# EAGLE schematic csa_ultracpu (EAGLE 6.4)

## Sheet 1 of 6: BUS I/O
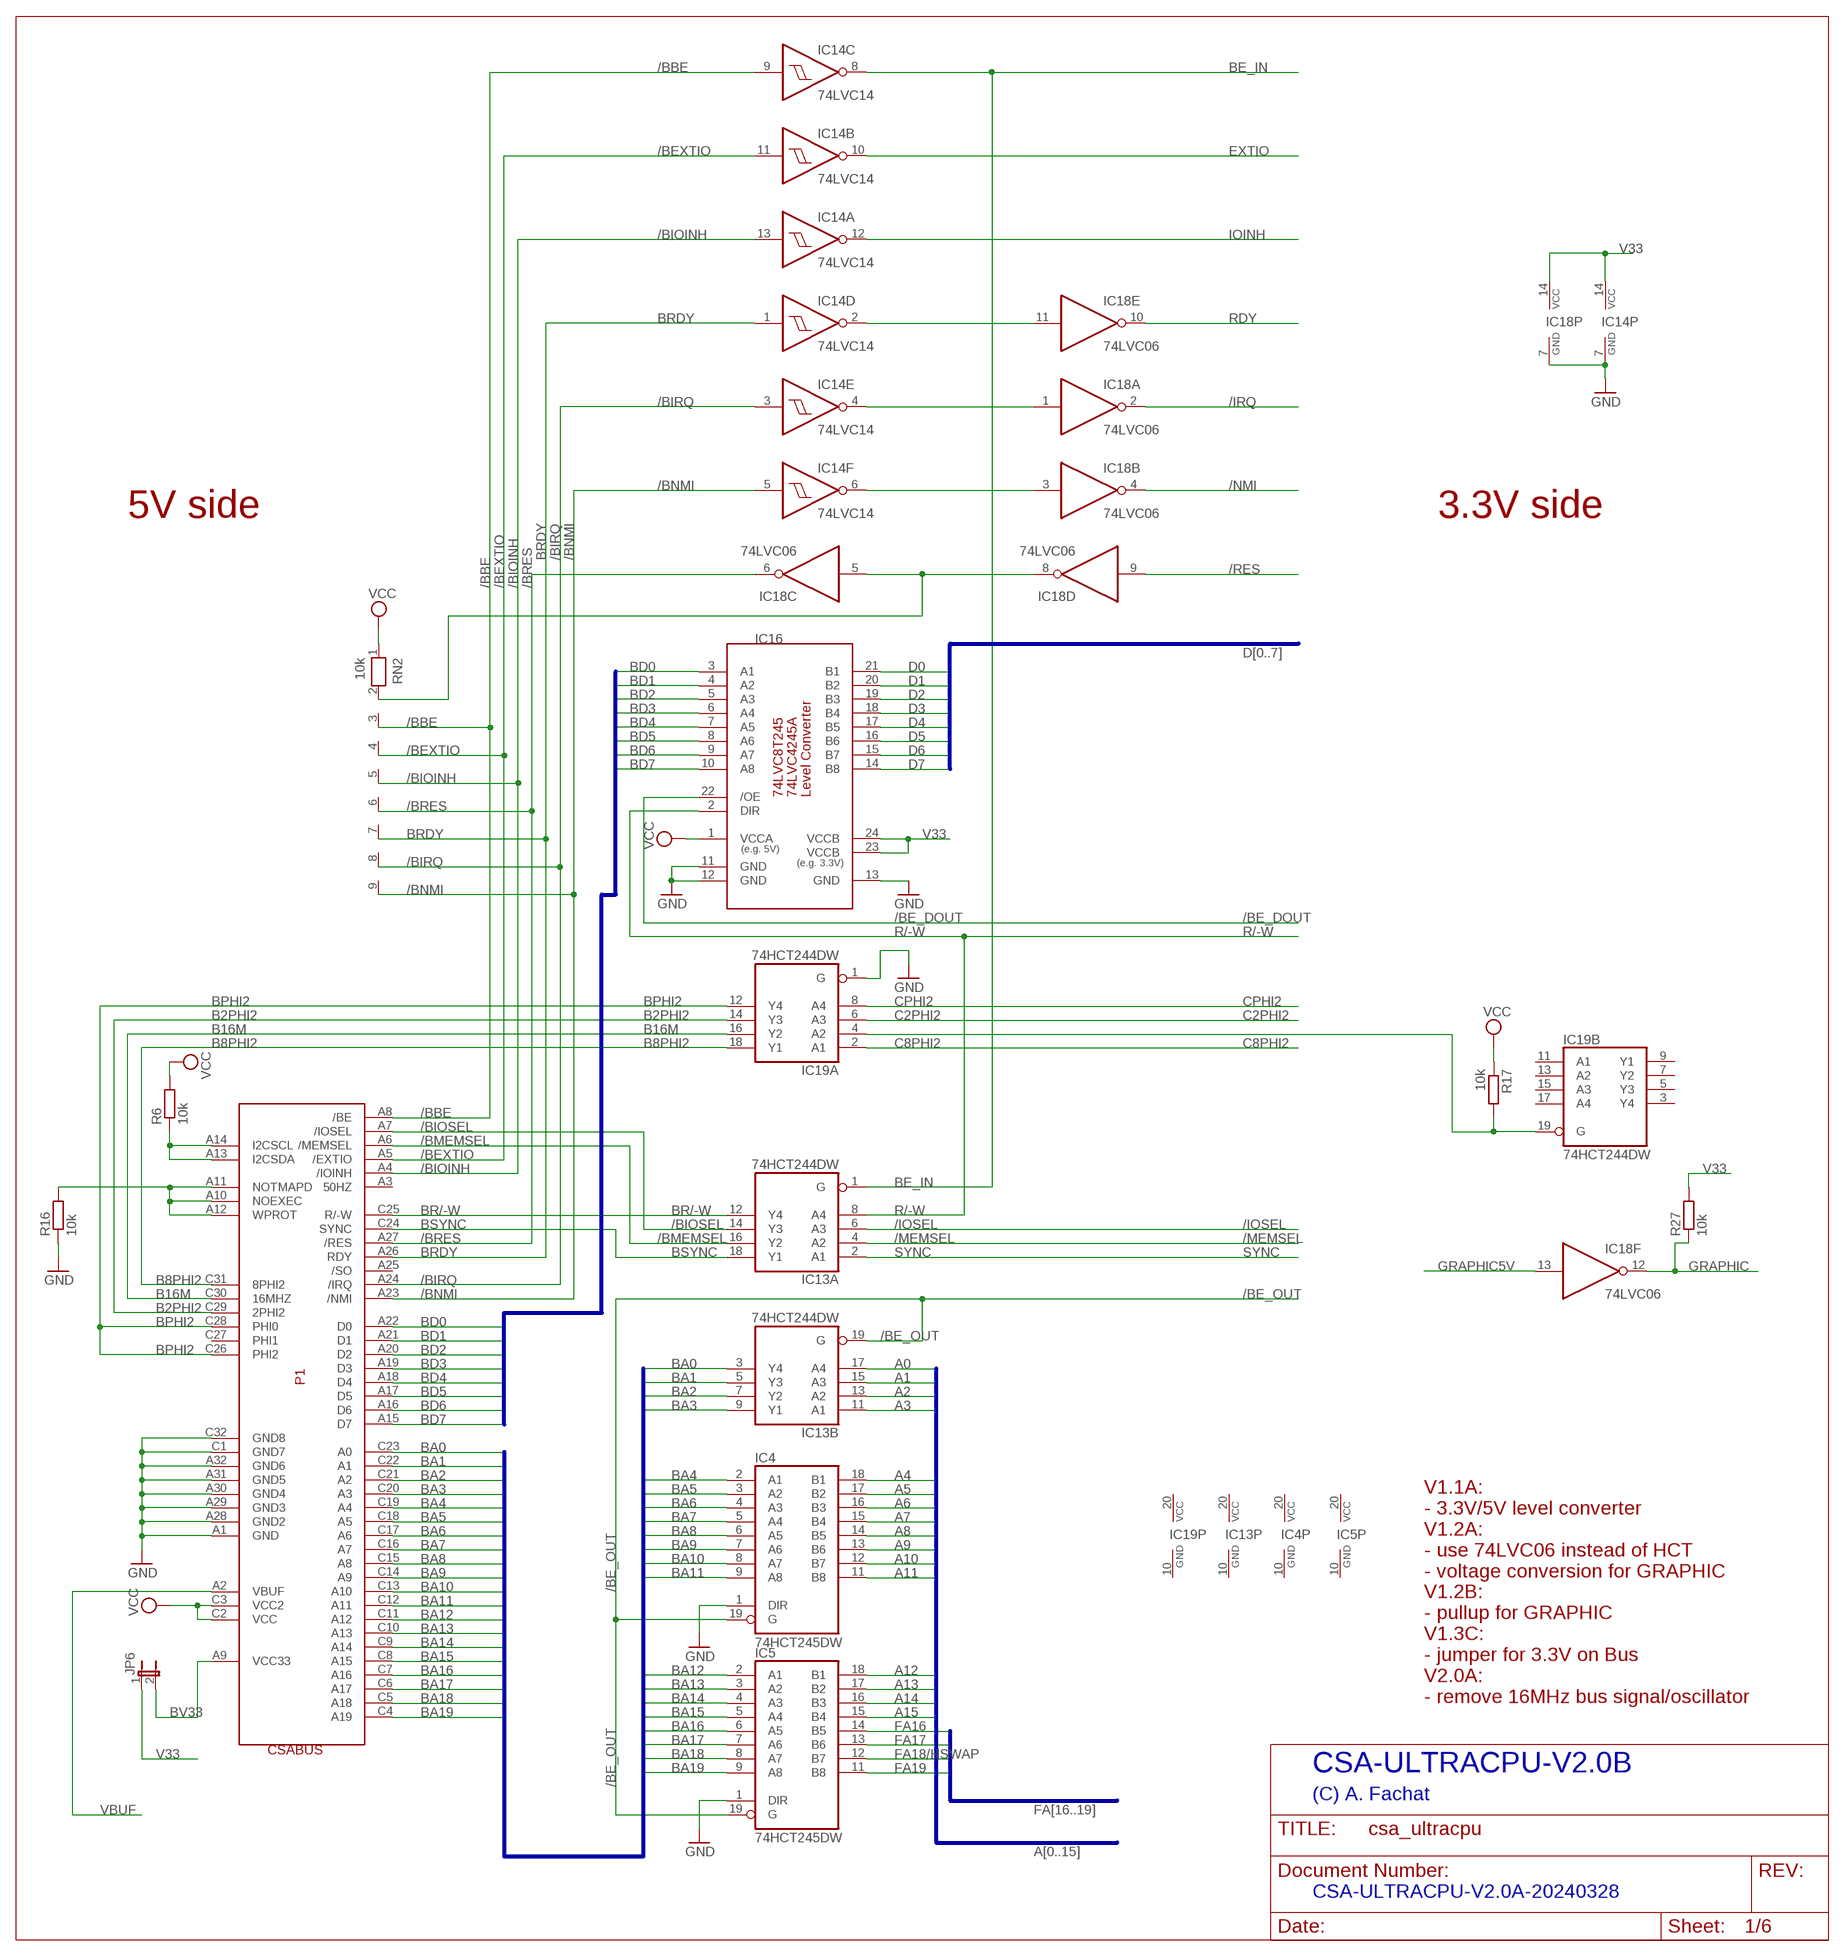
[diagram p0: schematic, sheet 1]

### Parts
IC4  74HCT245DW  74LS245DW  [SO20W]
IC5  74HCT245DW  74LS245DW  [SO20W]
IC13  74HCT244DW  [SO20W]
IC14  74LVC14  74HCT14D  [SO14]
IC16  74LVC8T245SO24  [SO24L]
IC18  74LVC06  74LS06D  [SO14]
IC19  74HCT244DW  [SO20W]
JP6  JP1E  [JP1]
P1  CSABUS  [CSABUS]
R6  10k  R-EU_0204/5  [0204/5]
R16  10k  R-EU_0204/5  [0204/5]
R17  10k  R-EU_0204/5  [0204/5]
R27  10k  R-EU_0204/5  [0204/5]
RN2  10k  RN08  [RN-9]

### Nets
/BBE: IC14.9(C:I) P1.A8(/BE) RN2.3
/BE_DOUT: IC16.22(/OE) ; also sheet 2
/BE_OUT: IC4.19(G) IC5.19(G) IC13.19(B:G) ; also sheet 2
/BEXTIO: IC14.11(B:I) P1.A5(/EXTIO) RN2.4
/BIOINH: IC14.13(A:I) P1.A4(/IOINH) RN2.5
/BIOSEL: IC13.14(A:Y3) P1.A7(/IOSEL)
/BIRQ: IC14.3(E:I) P1.A24(/IRQ) RN2.8
/BMEMSEL: IC13.16(A:Y2) P1.A6(/MEMSEL)
/BNMI: IC14.5(F:I) P1.A23(/NMI) RN2.9
/BRES: IC18.6(C:O) P1.A27(/RES) RN2.6
/IOSEL: IC13.6(A:A3) ; also sheet 2
/IRQ: IC18.2(A:O) ; also sheet 2,5
/MEMSEL: IC13.4(A:A2) ; also sheet 2
/NMI: IC18.4(B:O) ; also sheet 2
/RES: IC18.9(D:I) ; also sheet 2,3,5
A0: IC13.17(B:A4) ; also sheet 2
A1: IC13.15(B:A3) ; also sheet 2
A2: IC13.13(B:A2) ; also sheet 2
A3: IC13.11(B:A1) ; also sheet 2
A4: IC4.18(B1) ; also sheet 2
A5: IC4.17(B2) ; also sheet 2
A6: IC4.16(B3) ; also sheet 2
A7: IC4.15(B4) ; also sheet 2
A8: IC4.14(B5) ; also sheet 2
A9: IC4.13(B6) ; also sheet 2
A10: IC4.12(B7) ; also sheet 2
A11: IC4.11(B8) ; also sheet 2
A12: IC5.18(B1) ; also sheet 2
A13: IC5.17(B2) ; also sheet 2
A14: IC5.16(B3) ; also sheet 2
A15: IC5.15(B4) ; also sheet 2
B2PHI2: IC19.14(A:Y3) P1.C29(2PHI2)
B8PHI2: IC19.18(A:Y1) P1.C31(8PHI2)
B16M: IC19.16(A:Y2) P1.C30(16MHZ)
BA0: IC13.3(B:Y4) P1.C23(A0)
BA1: IC13.5(B:Y3) P1.C22(A1)
BA2: IC13.7(B:Y2) P1.C21(A2)
BA3: IC13.9(B:Y1) P1.C20(A3)
BA4: IC4.2(A1) P1.C19(A4)
BA5: IC4.3(A2) P1.C18(A5)
BA6: IC4.4(A3) P1.C17(A6)
BA7: IC4.5(A4) P1.C16(A7)
BA8: IC4.6(A5) P1.C15(A8)
BA9: IC4.7(A6) P1.C14(A9)
BA10: IC4.8(A7) P1.C13(A10)
BA11: IC4.9(A8) P1.C12(A11)
BA12: IC5.2(A1) P1.C11(A12)
BA13: IC5.3(A2) P1.C10(A13)
BA14: IC5.4(A3) P1.C9(A14)
BA15: IC5.5(A4) P1.C8(A15)
BA16: IC5.6(A5) P1.C7(A16)
BA17: IC5.7(A6) P1.C6(A17)
BA18: IC5.8(A7) P1.C5(A18)
BA19: IC5.9(A8) P1.C4(A19)
BD0: IC16.3(A1) P1.A22(D0)
BD1: IC16.4(A2) P1.A21(D1)
BD2: IC16.5(A3) P1.A20(D2)
BD3: IC16.6(A4) P1.A19(D3)
BD4: IC16.7(A5) P1.A18(D4)
BD5: IC16.8(A6) P1.A17(D5)
BD6: IC16.9(A7) P1.A16(D6)
BD7: IC16.10(A8) P1.A15(D7)
BE_IN: IC13.1(A:G) IC14.8(C:O) ; also sheet 2
BPHI2: IC19.12(A:Y4) P1.C26(PHI2) P1.C28(PHI0)
BR/-W: IC13.12(A:Y4) P1.C25(R/-W)
BRDY: IC14.1(D:I) P1.A26(RDY) RN2.7
BSYNC: IC13.18(A:Y1) P1.C24(SYNC)
BV33: JP6.2 P1.A9(VCC33)
C2PHI2: IC19.6(A:A3) ; also sheet 2
C8PHI2: IC19.2(A:A1) ; also sheet 2
CPHI2: IC19.8(A:A4) ; also sheet 2
D0: IC16.21(B1) ; also sheet 2
D1: IC16.20(B2) ; also sheet 2
D2: IC16.19(B3) ; also sheet 2
D3: IC16.18(B4) ; also sheet 2
D4: IC16.17(B5) ; also sheet 2
D5: IC16.16(B6) ; also sheet 2
D6: IC16.15(B7) ; also sheet 2
D7: IC16.14(B8) ; also sheet 2
EXTIO: IC14.10(B:O) ; also sheet 2
FA16: IC5.14(B5) ; also sheet 2
FA17: IC5.13(B6) ; also sheet 2
FA18/HSWAP: IC5.12(B7) ; also sheet 2
FA19: IC5.11(B8) ; also sheet 2
GND: IC4.1(DIR) IC5.1(DIR) IC14.7(P:GND) IC16.11(GND) IC16.12(GND) IC16.13(GND) IC18.7(P:GND) IC19.1(A:G) P1.A1(GND) P1.A28(GND2) P1.A29(GND3) P1.A30(GND4) P1.A31(GND5) P1.A32(GND6) P1.C1(GND7) P1.C32(GND8) R16.1 ; also sheet 2,3,4,5,6
GRAPHIC: IC18.12(F:O) R27.1 ; also sheet 2
GRAPHIC5V: IC18.13(F:I) ; also sheet 2
IOINH: IC14.12(A:O) ; also sheet 2
N$2: IC14.4(E:O) IC18.1(A:I)
N$3: IC14.6(F:O) IC18.3(B:I)
N$4: IC18.5(C:I) IC18.8(D:O) RN2.2
N$5: IC14.2(D:O) IC18.11(E:I)
N$11: IC19.4(A:A2) IC19.19(B:G) R17.2
N$43: P1.A10(NOEXEC) P1.A11(NOTMAPD) P1.A12(WPROT) R16.2
N$44: P1.A13(I2CSDA) P1.A14(I2CSCL) R6.1
R/-W: IC13.8(A:A4) IC16.2(DIR) ; also sheet 2
RDY: IC18.10(E:O) ; also sheet 2
SYNC: IC13.2(A:A1) ; also sheet 2
V33: IC14.14(P:VCC) IC16.23(VCCB) IC16.24(VCCB) IC18.14(P:VCC) JP6.1 R27.2 ; also sheet 2,3,5,6
VBUF: P1.A2(VBUF) ; also sheet 5
VCC: IC16.1(VCCA) P1.C2(VCC) P1.C3(VCC2) R6.2 R17.1 RN2.1 ; also sheet 2,3,4,5
Unconnected: IC19.3(B:Y4) IC19.5(B:Y3) IC19.7(B:Y2) IC19.9(B:Y1) IC19.11(B:A1) IC19.13(B:A2) IC19.15(B:A3) IC19.17(B:A4) P1.A3(50HZ) P1.A25(/SO) P1.C27(PHI1)

### Buses
BD[0..7]
BA[0..19]
A[0..15]
D[0..7]
FA[16..19]

### Notes on the sheet
- 5V side | 3.3V side
- V1.1A:
  - 3.3V/5V level converter
  V1.2A:
  - use 74LVC06 instead of HCT
  - voltage conversion for GRAPHIC
  V1.2B:
  - pullup for GRAPHIC
  V1.3C:
  - jumper for 3.3V on Bus
  V2.0A:
  - remove 16MHz bus signal/oscillator
- CSA-ULTRACPU-V2.0B
- (C) A. Fachat
- CSA-ULTRACPU-V2.0A-20240328

## Sheet 2 of 6: CPU,RAM,ROM
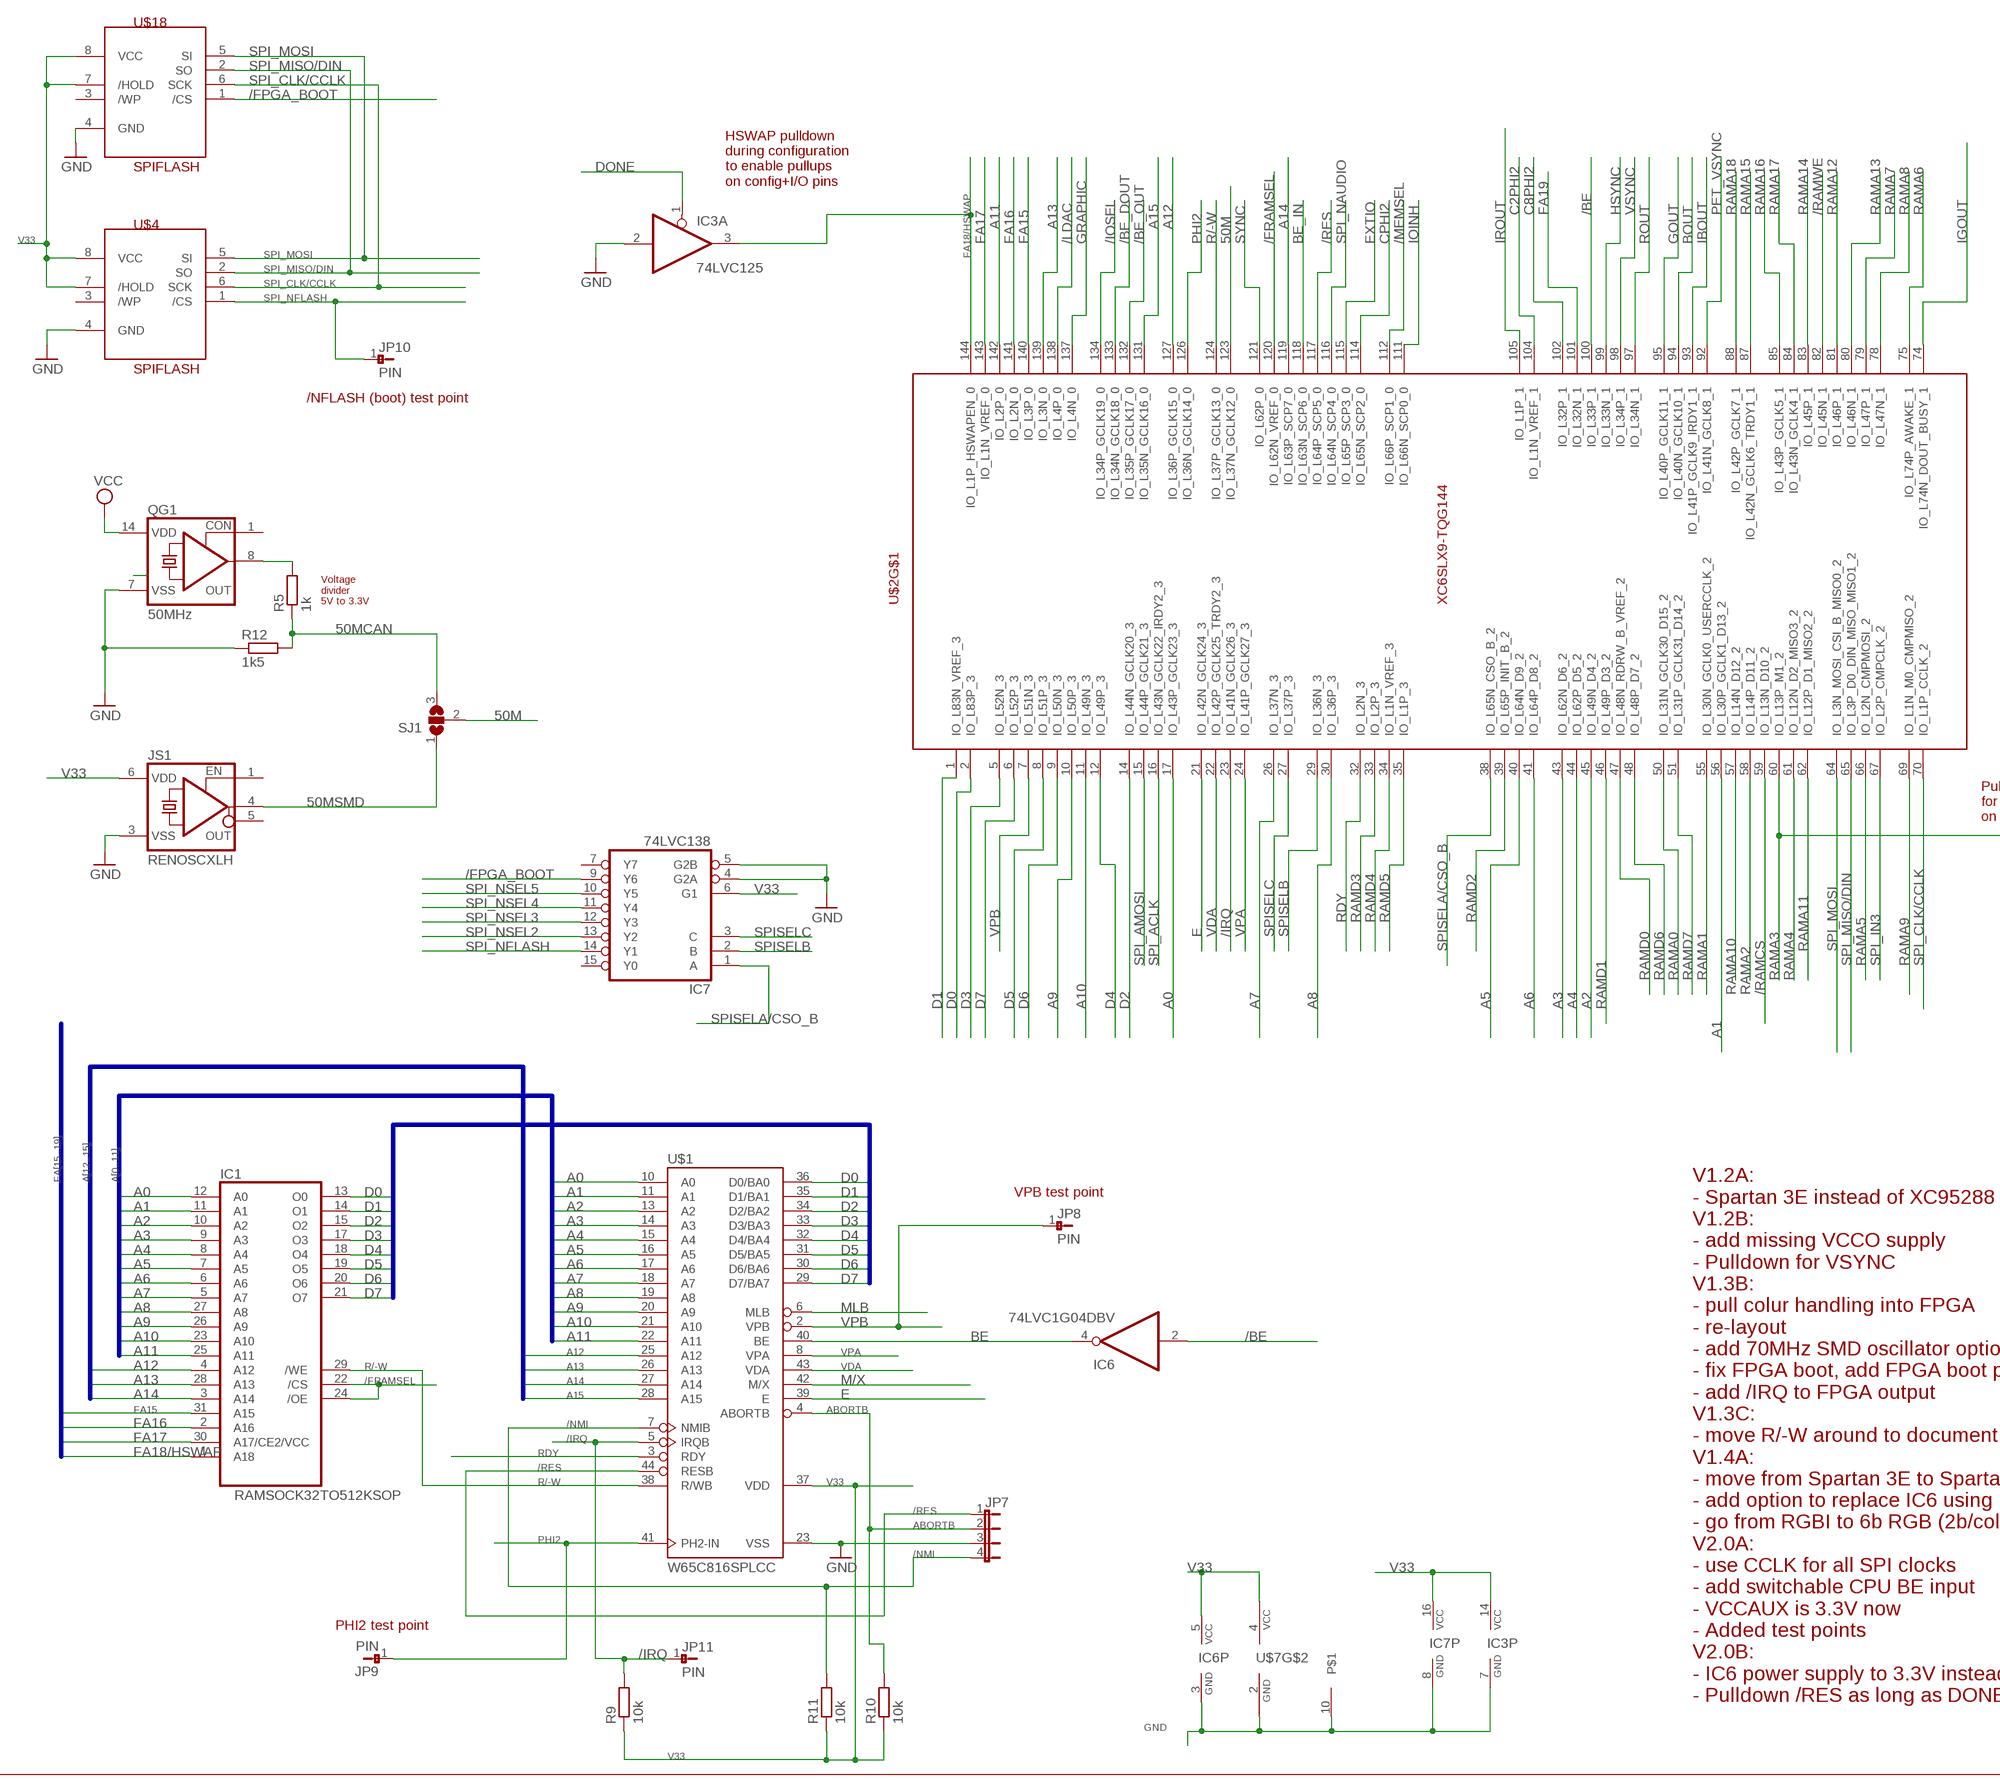
[diagram p1: schematic, sheet 2, part 1 of 2]
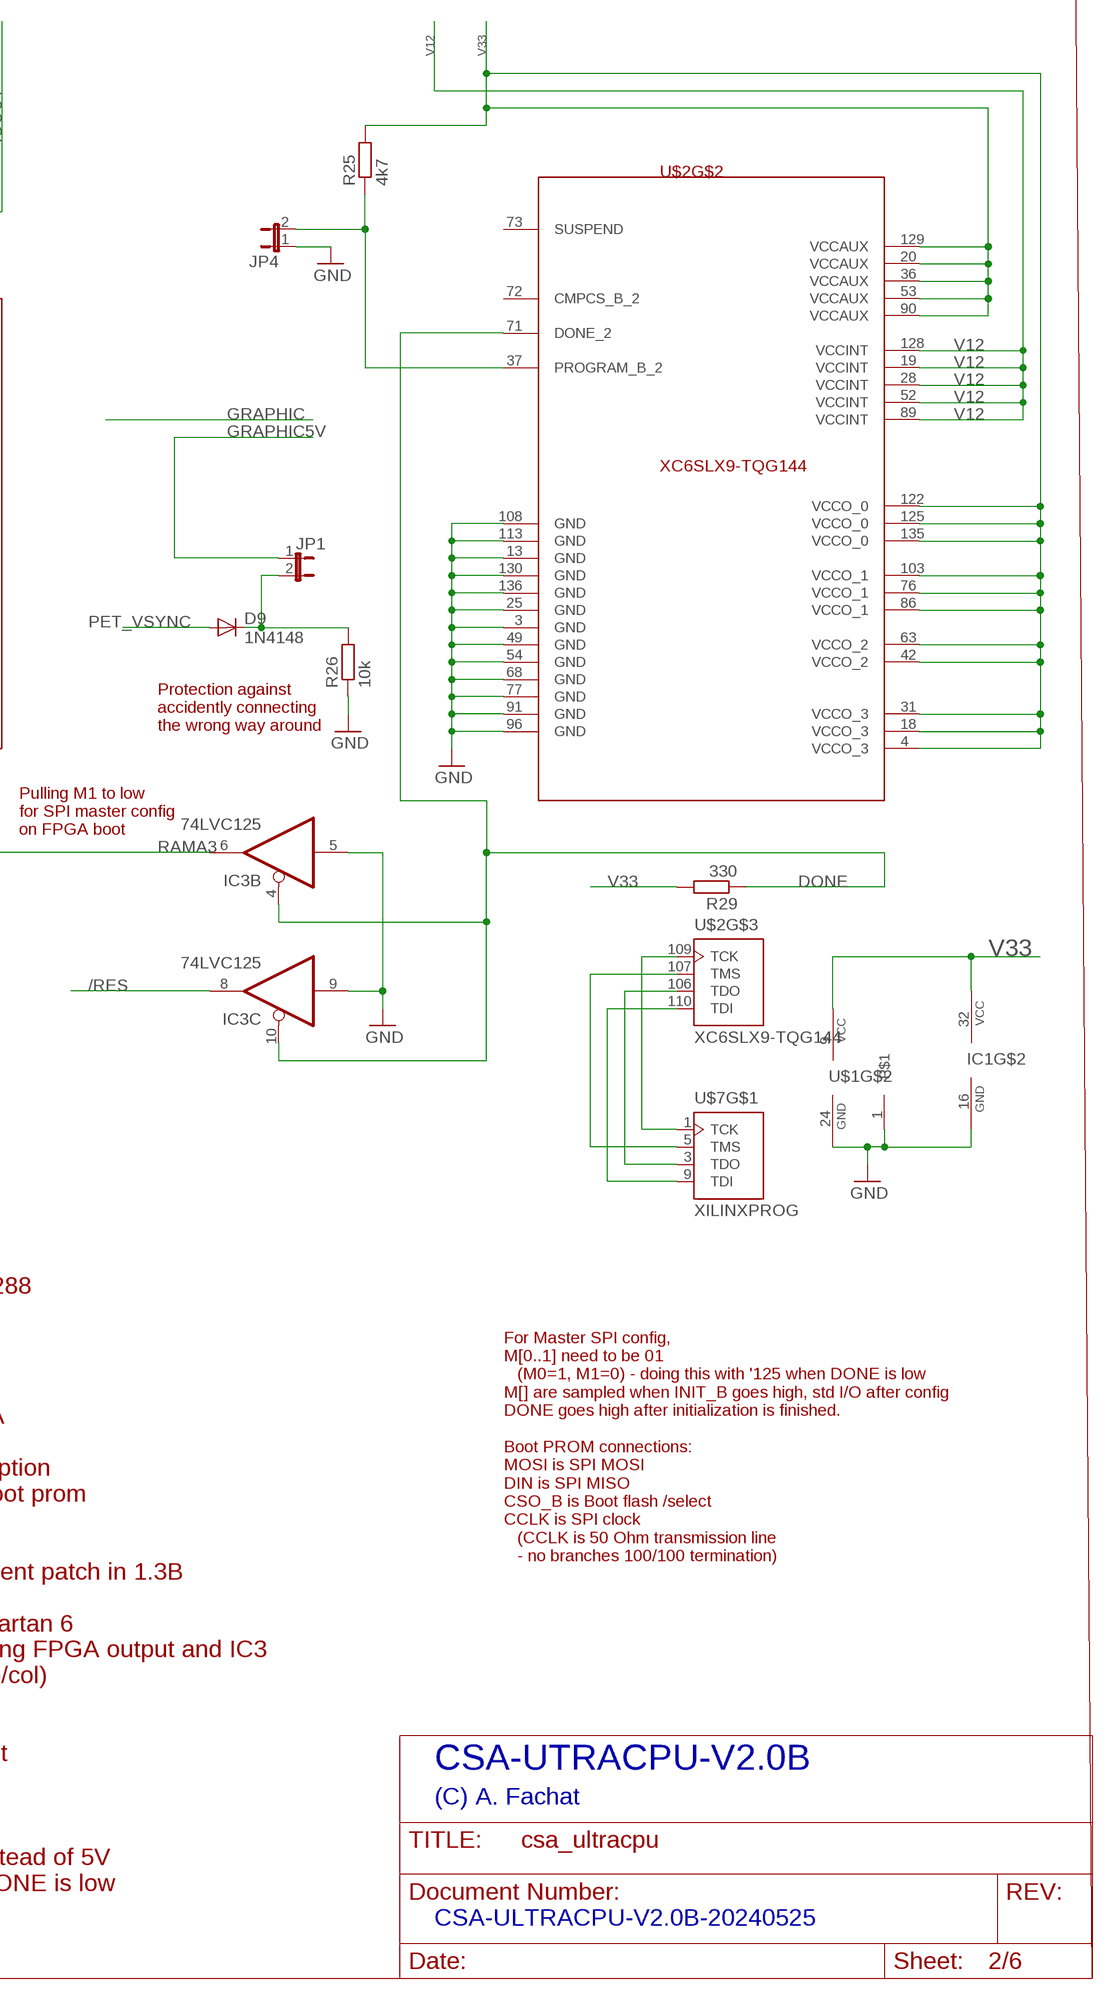
[diagram p2: schematic, sheet 2, part 2 of 2]

### Parts
D9  1N4148  DIODE-D-5  [D-5]
IC1  RAMSOCK32TO512KSOP  [SOP32]
IC3  74LVC125  74LS125D  [SO14]
IC6  74LVC1G04DBV  [SOT23-5]
IC7  74LVC138  74S138D  [SO16]
JP1  JP1E  [JP1]
JP4  JP1E  [JP1]
JP7  JP4E  [JP4]
JP8  PIN  [PIN]
JP9  PIN  [PIN]
JP10  PIN  [PIN]
JP11  PIN  [PIN]
JS1  RENOSCXLH  [RENJS6]
QG1  50MHz  CRYSTAL_RES-SG51  [SG51]
R5  1k  R-EU_0207/2V  [0207/2V]
R9  10k  R-EU_0207/2V  [0207/2V]
R10  10k  R-EU_0207/2V  [0207/2V]
R11  10k  R-EU_0207/2V  [0207/2V]
R12  1k5  R-EU_0207/2V  [0207/2V]
R25  4k7  R-EU_0207/2V  [0207/2V]
R26  10k  R-EU_0207/2V  [0207/2V]
R29  330  R-EU_0207/2V  [0207/2V]
SJ1  SJ2W  [SJ_2]
U$1  W65C816SPLCC  [PLCC44]
U$2  XC6SLX9-TQG144  XC9SLX9-TQG144  [TQFP144]
U$4  SPIFLASH  [DIL08]
U$7  XILINXPROG  [FLAT10BOX]
U$18  SPIFLASH  [DIL08]

### Nets
50M: SJ1.2 U$2.123(IO_L37N_GCLK12_0)
50MCAN: R5.1 R12.2 SJ1.3
50MSMD: JS1.4(OUT1) SJ1.1
/BE: IC6.2(I) U$2.100(IO_L33P_1)
/BE_DOUT: U$2.133(IO_L34N_GCLK18_0) ; also sheet 1
/BE_OUT: U$2.132(IO_L35P_GCLK17_0) ; also sheet 1
/FPGA_BOOT: IC7.9(Y6) U$18.1(/CS)
/FRAMSEL: IC1.22(/CS) IC1.24(/OE) U$2.120(IO_L62N_VREF_0)
/IOSEL: U$2.134(IO_L34P_GCLK19_0) ; also sheet 1
/IRQ: JP11.1 R9.2 U$1.5(IRQB) U$2.23(IO_L41N_GCLK26_3) ; also sheet 1,5
/LDAC: U$2.138(IO_L4P_0) ; also sheet 6
/MEMSEL: U$2.112(IO_L66P_SCP1_0) ; also sheet 1
/NMI: JP7.4 R11.2 U$1.7(NMIB) ; also sheet 1
/RAMCS: U$2.59(IO_L13N_D10_2) ; also sheet 6
/RAMWE: U$2.82(IO_L45N_1) ; also sheet 6
/RES: IC3.8(C:O) JP7.1 U$1.44(RESB) U$2.117(IO_L64P_SCP5_0) ; also sheet 1,3,5
A0: IC1.12(A0) U$1.10(A0) U$2.17(IO_L43P_GCLK23_3) ; also sheet 1
A1: IC1.11(A1) U$1.11(A1) U$2.56(IO_L30P_GCLK1_D13_2) ; also sheet 1
A2: IC1.10(A2) U$1.13(A2) U$2.45(IO_L49N_D4_2) ; also sheet 1
A3: IC1.9(A3) U$1.14(A3) U$2.43(IO_L62N_D6_2) ; also sheet 1
A4: IC1.8(A4) U$1.15(A4) U$2.44(IO_L62P_D5_2) ; also sheet 1
A5: IC1.7(A5) U$1.16(A5) U$2.40(IO_L64N_D9_2) ; also sheet 1
A6: IC1.6(A6) U$1.17(A6) U$2.41(IO_L64P_D8_2) ; also sheet 1
A7: IC1.5(A7) U$1.18(A7) U$2.26(IO_L37N_3) ; also sheet 1
A8: IC1.27(A8) U$1.19(A8) U$2.30(IO_L36P_3) ; also sheet 1
A9: IC1.26(A9) U$1.20(A9) U$2.10(IO_L50P_3) ; also sheet 1
A10: IC1.23(A10) U$1.21(A10) U$2.11(IO_L49N_3) ; also sheet 1
A11: IC1.25(A11) U$1.22(A11) U$2.142(IO_L2P_0) ; also sheet 1
A12: IC1.4(A12) U$1.25(A12) U$2.127(IO_L36P_GCLK15_0) ; also sheet 1
A13: IC1.28(A13) U$1.26(A13) U$2.139(IO_L3N_0) ; also sheet 1
A14: IC1.3(A14) U$1.27(A14) U$2.119(IO_L63P_SCP7_0) ; also sheet 1
A15: U$1.28(A15) U$2.131(IO_L35N_GCLK16_0) ; also sheet 1
ABORTB: JP7.2 R10.2 U$1.4(ABORTB)
BE: IC6.4(O) U$1.40(BE)
BE_IN: U$2.118(IO_L63N_SCP6_0) ; also sheet 1
BOUT: U$2.94(IO_L40N_GCLK10_1) ; also sheet 4
C2PHI2: U$2.104(IO_L1N_VREF_1) ; also sheet 1
C8PHI2: U$2.102(IO_L32P_1) ; also sheet 1
CPHI2: U$2.114(IO_L65N_SCP2_0) ; also sheet 1
D0: IC1.13(O0) U$1.36(D0/BA0) U$2.2(IO_L83P_3) ; also sheet 1
D1: IC1.14(O1) U$1.35(D1/BA1) U$2.1(IO_L83N_VREF_3) ; also sheet 1
D2: IC1.15(O2) U$1.34(D2/BA2) U$2.14(IO_L44N_GCLK20_3) ; also sheet 1
D3: IC1.17(O3) U$1.33(D3/BA3) U$2.5(IO_L52N_3) ; also sheet 1
D4: IC1.18(O4) U$1.32(D4/BA4) U$2.12(IO_L49P_3) ; also sheet 1
D5: IC1.19(O5) U$1.31(D5/BA5) U$2.8(IO_L51P_3) ; also sheet 1
D6: IC1.20(O6) U$1.30(D6/BA6) U$2.9(IO_L50N_3) ; also sheet 1
D7: IC1.21(O7) U$1.29(D7/BA7) U$2.6(IO_L52P_3) ; also sheet 1
DONE: IC3.1(A:OE) IC3.4(B:OE) IC3.10(C:OE) R29.1 U$2.71(DONE_2)
E: U$1.39(E) U$2.21(IO_L42N_GCLK24_3)
EXTIO: U$2.115(IO_L65P_SCP3_0) ; also sheet 1
FA15: IC1.31(A15) U$2.140(IO_L3P_0)
FA16: IC1.2(A16) U$2.141(IO_L2N_0) ; also sheet 1
FA17: IC1.30(A17/CE2/VCC) U$2.143(IO_L1N_VREF_0) ; also sheet 1
FA18/HSWAP: IC1.1(A18) IC3.3(A:O) U$2.144(IO_L1P_HSWAPEN_0) ; also sheet 1
FA19: U$2.101(IO_L32N_1) ; also sheet 1
GND: IC1.16(GND) IC3.2(A:I) IC3.5(B:I) IC3.7(P:GND) IC3.9(C:I) IC6.3(GND) IC7.4(G2A) IC7.5(G2B) IC7.8(GND) JP4.1 JP7.3 JS1.3(VSS) QG1.7(VSS) R12.1 R26.1 U$1.1 U$1.23(VSS) U$1.24(GND) U$2.3(GND) U$2.13(GND) U$2.25(GND) U$2.49(GND) U$2.54(GND) U$2.68(GND) U$2.77(GND) U$2.91(GND) U$2.96(GND) U$2.108(GND) U$2.113(GND) U$2.130(GND) U$2.136(GND) U$4.4(GND) U$7.2(GND) U$7.10 U$18.4(GND) ; also sheet 1,3,4,5,6
GOUT: U$2.95(IO_L40P_GCLK11_1) ; also sheet 4
GRAPHIC: U$2.137(IO_L4N_0) ; also sheet 1
GRAPHIC5V: JP1.1 ; also sheet 1
HSYNC: U$2.99(IO_L33N_1) ; also sheet 4
IBOUT: U$2.93(IO_L41P_GCLK9_IRDY1_1) ; also sheet 4
IGOUT: U$2.74(IO_L74N_DOUT_BUSY_1) ; also sheet 4
IOINH: U$2.111(IO_L66N_SCP0_0) ; also sheet 1
IROUT: U$2.105(IO_L1P_1) ; also sheet 4
M/X: U$1.42(M/X)
MLB: U$1.6(MLB)
N$7: QG1.8(OUT) R5.2
N$21: D9.C JP1.2 R26.2
PET_VSYNC: D9.A U$2.92(IO_L41N_GCLK8_1)
PHI2: JP9.1 U$1.41(PH2-IN) U$2.126(IO_L36N_GCLK14_0)
PROG_B: JP4.2 R25.1 U$2.37(PROGRAM_B_2)
R/-W: IC1.29(/WE) U$1.38(R/WB) U$2.124(IO_L37P_GCLK13_0) ; also sheet 1
RAMA0: U$2.50(IO_L31N_GCLK30_D15_2) ; also sheet 6
RAMA1: U$2.55(IO_L30N_GCLK0_USERCCLK_2) ; also sheet 6
RAMA2: U$2.58(IO_L14P_D11_2) ; also sheet 6
RAMA3: IC3.6(B:O) U$2.60(IO_L13P_M1_2) ; also sheet 6
RAMA4: U$2.61(IO_L12N_D2_MISO3_2) ; also sheet 6
RAMA5: U$2.66(IO_L2N_CMPMOSI_2) ; also sheet 6
RAMA6: U$2.75(IO_L74P_AWAKE_1) ; also sheet 6
RAMA7: U$2.79(IO_L47P_1) ; also sheet 6
RAMA8: U$2.78(IO_L47N_1) ; also sheet 6
RAMA9: U$2.69(IO_L1N_M0_CMPMISO_2) ; also sheet 6
RAMA10: U$2.57(IO_L14N_D12_2) ; also sheet 6
RAMA11: U$2.62(IO_L12P_D1_MISO2_2) ; also sheet 6
RAMA12: U$2.81(IO_L46P_1) ; also sheet 6
RAMA13: U$2.80(IO_L46N_1) ; also sheet 6
RAMA14: U$2.83(IO_L45P_1) ; also sheet 6
RAMA15: U$2.87(IO_L42N_GCLK6_TRDY1_1) ; also sheet 6
RAMA16: U$2.85(IO_L43P_GCLK5_1) ; also sheet 6
RAMA17: U$2.84(IO_L43N_GCLK4_1) ; also sheet 6
RAMA18: U$2.88(IO_L42P_GCLK7_1) ; also sheet 6
RAMD0: U$2.47(IO_L48N_RDRW_B_VREF_2) ; also sheet 6
RAMD1: U$2.46(IO_L49P_D3_2) ; also sheet 6
RAMD2: U$2.39(IO_L65P_INIT_B_2) ; also sheet 6
RAMD3: U$2.33(IO_L2P_3) ; also sheet 6
RAMD4: U$2.34(IO_L1N_VREF_3) ; also sheet 6
RAMD5: U$2.35(IO_L1P_3) ; also sheet 6
RAMD6: U$2.48(IO_L48P_D7_2) ; also sheet 6
RAMD7: U$2.51(IO_L31P_GCLK31_D14_2) ; also sheet 6
RDY: U$1.3(RDY) U$2.32(IO_L2N_3) ; also sheet 1
ROUT: U$2.97(IO_L34N_1) ; also sheet 4
SPI_ACLK: U$2.16(IO_L43N_GCLK22_IRDY2_3) ; also sheet 6
SPI_AMOSI: U$2.15(IO_L44P_GCLK21_3) ; also sheet 6
SPI_CLK/CCLK: U$2.70(IO_L1P_CCLK_2) U$4.6(SCK) U$18.6(SCK) ; also sheet 5
SPI_IN3: U$2.67(IO_L2P_CMPCLK_2) ; also sheet 5
SPI_MISO/DIN: U$2.65(IO_L3P_D0_DIN_MISO_MISO1_2) U$4.2(SO) U$18.2(SO) ; also sheet 5
SPI_MOSI: U$2.64(IO_L3N_MOSI_CSI_B_MISO0_2) U$4.5(SI) U$18.5(SI) ; also sheet 5
SPI_NAUDIO: U$2.116(IO_L64N_SCP4_0) ; also sheet 6
SPI_NFLASH: IC7.14(Y1) JP10.1 U$4.1(/CS)
SPI_NSEL2: IC7.13(Y2) ; also sheet 5
SPI_NSEL3: IC7.12(Y3) ; also sheet 5
SPI_NSEL4: IC7.11(Y4) ; also sheet 5
SPI_NSEL5: IC7.10(Y5) ; also sheet 5
SPISELA/CSO_B: IC7.1(A) U$2.38(IO_L65N_CSO_B_2)
SPISELB: IC7.2(B) U$2.29(IO_L36N_3)
SPISELC: IC7.3(C) U$2.27(IO_L37P_3)
SYNC: U$2.121(IO_L62P_0) ; also sheet 1
TCK: U$2.109(TCK) U$7.1(TCK)
TDI: U$2.110(TDI) U$7.9(TDI)
TDO: U$2.106(TDO) U$7.3(TDO)
TMS: U$2.107(TMS) U$7.5(TMS)
V12: U$2.19(VCCINT) U$2.28(VCCINT) U$2.52(VCCINT) U$2.89(VCCINT) U$2.128(VCCINT) ; also sheet 3
V33: IC1.32(VCC) IC3.14(P:VCC) IC6.5(VCC) IC7.6(G1) IC7.16(VCC) JS1.6(VDD) R9.1 R10.1 R11.1 R25.2 R29.2 U$1.9(VCC) U$1.37(VDD) U$2.4(VCCO_3) U$2.18(VCCO_3) U$2.20(VCCAUX) U$2.31(VCCO_3) U$2.36(VCCAUX) U$2.42(VCCO_2) U$2.53(VCCAUX) U$2.63(VCCO_2) U$2.76(VCCO_1) U$2.86(VCCO_1) U$2.90(VCCAUX) U$2.103(VCCO_1) U$2.122(VCCO_0) U$2.125(VCCO_0) U$2.129(VCCAUX) U$2.135(VCCO_0) U$4.7(/HOLD) U$4.8(VCC) U$7.4(VCC) U$18.7(/HOLD) U$18.8(VCC) ; also sheet 1,3,5,6
VCC: QG1.14(VDD) ; also sheet 1,3,4,5
VDA: U$1.43(VDA) U$2.22(IO_L42P_GCLK25_TRDY2_3)
VPA: U$1.8(VPA) U$2.24(IO_L41P_GCLK27_3)
VPB: JP8.1 U$1.2(VPB) U$2.7(IO_L51N_3)
VSYNC: U$2.98(IO_L34P_1) ; also sheet 4
Unconnected: IC3.11(D:O) IC3.12(D:I) IC3.13(D:OE) IC7.7(Y7) IC7.15(Y0) JS1.1(EN) JS1.5(OUT2) QG1.1(CON) U$2.72(CMPCS_B_2) U$2.73(SUSPEND) U$4.3(/WP) U$18.3(/WP)

### Buses
A[0..11]
D[0..7]
A[12..15]
FA[15..19]

### Notes on the sheet
- HSWAP pulldown
  during configuration
  to enable pullups
  on config+I/O pins
- /NFLASH (boot) test point
- Voltage
  divider
  5V to 3.3V
- Protection against
  accidently connecting
  the wrong way around
- Pulling M1 to low 
  for SPI master config
  on FPGA boot
- VPB test point
- For Master SPI config,
  M[0..1] need to be 01 
     (M0=1, M1=0) - doing this with '125 when DONE is low
  M[] are sampled when INIT_B goes high, std I/O after config
  DONE goes high after initialization is finished.
  
  Boot PROM connections:
  MOSI is SPI MOSI
  DIN is SPI MISO
  CSO_B is Boot flash /select
  CCLK is SPI clock
     (CCLK is 50 Ohm transmission line 
     - no branches 100/100 termination)
- CSA-UTRACPU-V2.0B
- PHI2 test point | (C) A. Fachat
- V1.2A:
  - Spartan 3E instead of XC95288
  V1.2B:
  - add missing VCCO supply
  - Pulldown for VSYNC
  V1.3B:
  - pull colur handling into FPGA
  - re-layout
  - add 70MHz SMD oscillator option
  - fix FPGA boot, add FPGA boot prom
  - add /IRQ to FPGA output
  V1.3C:
  - move R/-W around to document patch in 1.3B
  V1.4A:
  - move from Spartan 3E to Spartan 6
  - add option to replace IC6 using FPGA output and IC3
  - go from RGBI to 6b RGB (2b/col)
  V2.0A:
  - use CCLK for all SPI clocks
  - add switchable CPU BE input
  - VCCAUX is 3.3V now
  - Added test points
  V2.0B:
  - IC6 power supply to 3.3V instead of 5V
  - Pulldown /RES as long as DONE is low
- CSA-ULTRACPU-V2.0B-20240525

## Sheet 3 of 6: Power
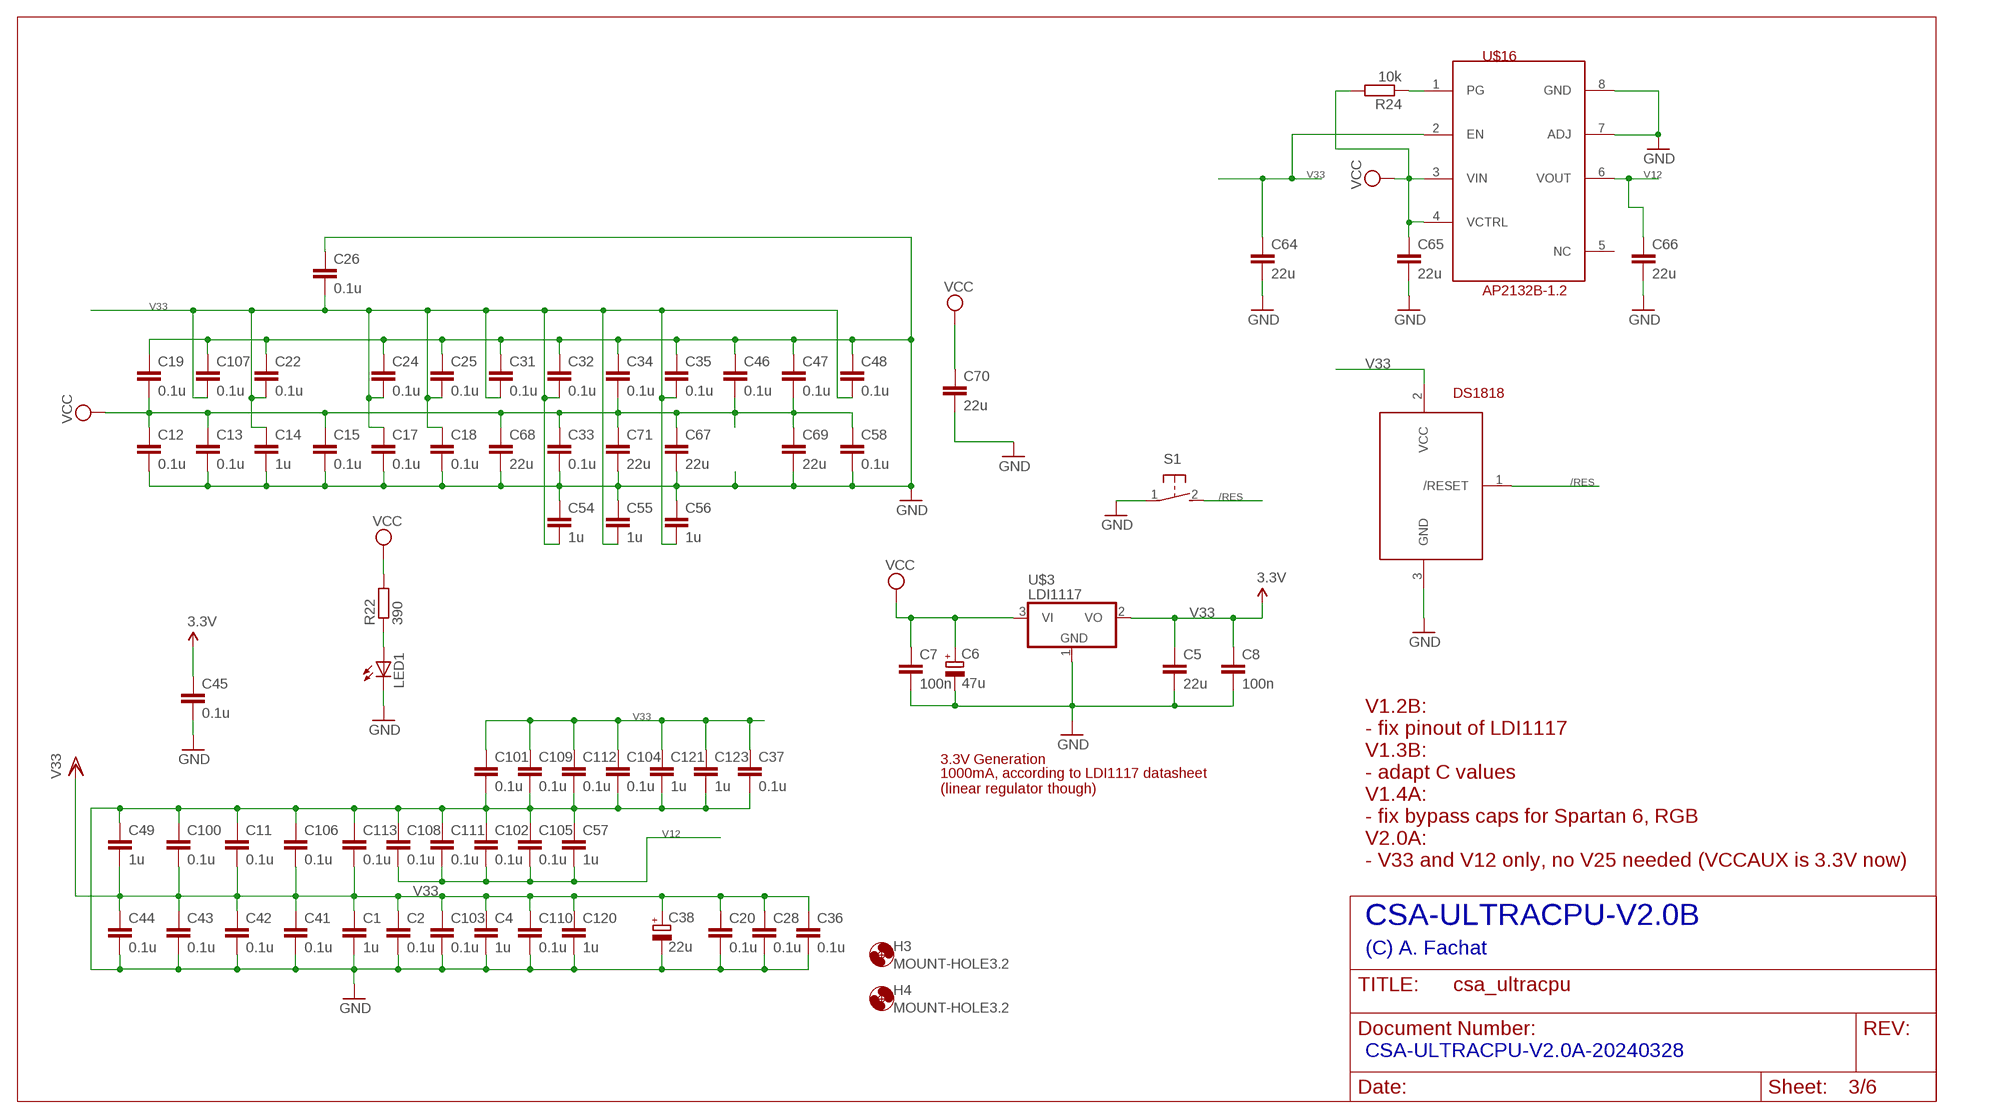
[diagram p3: schematic, sheet 3]

### Parts
C1  1u  C-EUC0603  [C0603]
C2  0.1u  C-EUC0603  [C0603]
C4  1u  C-EUC0603  [C0603]
C5  22u  C-EUC0805  [C0805]
C6  47u  CPOL-EUE2.5-6  [E2,5-6]
C7  100n  C-EUC0603  [C0603]
C8  100n  C-EUC0603  [C0603]
C11  0.1u  C-EUC0603  [C0603]
C12  0.1u  C-EUC0603  [C0603]
C13  0.1u  C-EUC0603  [C0603]
C14  1u  C-EUC0603  [C0603]
C15  0.1u  C-EUC0603  [C0603]
C17  0.1u  C-EUC0603  [C0603]
C18  0.1u  C-EUC0603  [C0603]
C19  0.1u  C-EUC0603  [C0603]
C20  0.1u  C-EUC0603  [C0603]
C22  0.1u  C-EUC0603  [C0603]
C24  0.1u  C-EUC0603  [C0603]
C25  0.1u  C-EUC0603  [C0603]
C26  0.1u  C-EUC0603  [C0603]
C28  0.1u  C-EUC0603  [C0603]
C31  0.1u  C-EUC0603  [C0603]
C32  0.1u  C-EUC0603  [C0603]
C33  0.1u  C-EUC0603  [C0603]
C34  0.1u  C-EUC0603  [C0603]
C35  0.1u  C-EUC0603  [C0603]
C36  0.1u  C-EUC0603  [C0603]
C37  0.1u  C-EUC0603  [C0603]
C38  22u  CPOL-EUE2.5-6  [E2,5-6]
C41  0.1u  C-EUC0603  [C0603]
C42  0.1u  C-EUC0603  [C0603]
C43  0.1u  C-EUC0603  [C0603]
C44  0.1u  C-EUC0603  [C0603]
C45  0.1u  C-EUC0603  [C0603]
C46  0.1u  C-EUC0603  [C0603]
C47  0.1u  C-EUC0603  [C0603]
C48  0.1u  C-EUC0603  [C0603]
C49  1u  C-EUC0603  [C0603]
C54  1u  C-EUC0603  [C0603]
C55  1u  C-EUC0603  [C0603]
C56  1u  C-EUC0603  [C0603]
C57  1u  C-EUC0603  [C0603]
C58  0.1u  C-EUC0603  [C0603]
C64  22u  C-EUC0805  [C0805]
C65  22u  C-EUC0805  [C0805]
C66  22u  C-EUC0805  [C0805]
C67  22u  C-EUC0805  [C0805]
C68  22u  C-EUC0805  [C0805]
C69  22u  C-EUC0805  [C0805]
C70  22u  C-EUC0805  [C0805]
C71  22u  C-EUC0805  [C0805]
C100  0.1u  C-EUC0603  [C0603]
C101  0.1u  C-EUC0603  [C0603]
C102  0.1u  C-EUC0603  [C0603]
C103  0.1u  C-EUC0603  [C0603]
C104  0.1u  C-EUC0603  [C0603]
C105  0.1u  C-EUC0603  [C0603]
C106  0.1u  C-EUC0603  [C0603]
C107  0.1u  C-EUC0603  [C0603]
C108  0.1u  C-EUC0603  [C0603]
C109  0.1u  C-EUC0603  [C0603]
C110  0.1u  C-EUC0603  [C0603]
C111  0.1u  C-EUC0603  [C0603]
C112  0.1u  C-EUC0603  [C0603]
C113  0.1u  C-EUC0603  [C0603]
C120  1u  C-EUC0603  [C0603]
C121  1u  C-EUC0603  [C0603]
C123  1u  C-EUC0603  [C0603]
DS1818  DS1818  DS1813  [TO92]
H3  MOUNT-HOLE3.2  [3,2]
H4  MOUNT-HOLE3.2  [3,2]
LED1  LED3MM  [LED3MM]
R22  390  R-EU_0207/2V  [0207/2V]
R24  10k  R-EU_0207/2V  [0207/2V]
S1  31-XX  [B3F-31XX]
U$3  LDI1117  [SOT223]
U$16  AP2132B-1.2  AP2132BB  [PSOP-8-FIXED]

### Nets
/RES: DS1818.1(/RESET) S1.2(S) ; also sheet 1,2,5
GND: C1.2 C2.2 C4.2 C5.2 C6.- C7.2 C8.2 C11.1 C12.2 C13.2 C14.2 C15.2 C17.2 C18.2 C19.1 C20.2 C22.1 C24.1 C25.1 C26.1 C28.2 C31.1 C32.1 C33.2 C34.1 C35.1 C36.2 C37.2 C38.- C41.2 C42.2 C43.2 C44.2 C45.2 C46.1 C47.1 C48.1 C49.1 C54.1 C55.1 C56.1 C57.1 C58.2 C64.2 C65.2 C66.2 C67.2 C68.2 C69.2 C70.2 C71.2 C100.1 C101.2 C102.1 C103.2 C104.2 C105.1 C106.1 C107.1 C108.1 C109.2 C110.2 C111.1 C112.2 C113.1 C120.2 C121.2 C123.2 DS1818.3(GND) LED1.K(C) S1.1(P) U$3.1(GND) U$16.7(ADJ) U$16.8(GND) ; also sheet 1,2,4,5,6
N$12: R24.1 U$16.1(PG)
N$46: LED1.A R22.1
V12: C57.2 C66.1 C102.2 C105.2 C108.2 C111.2 U$16.6(VOUT) ; also sheet 2
V33: C1.1 C2.1 C4.1 C5.1 C8.1 C11.2 C14.1 C17.1 C18.1 C20.1 C22.2 C24.2 C25.2 C26.2 C28.1 C31.2 C32.2 C35.2 C36.1 C37.1 C38.+ C41.1 C42.1 C43.1 C44.1 C45.1 C48.2 C49.2 C54.2 C55.2 C56.2 C64.1 C100.2 C101.1 C103.1 C104.1 C106.2 C107.2 C109.1 C110.1 C112.1 C113.2 C120.1 C121.1 C123.1 DS1818.2(VCC) U$3.2(VO) U$16.2(EN) ; supply symbol labelled 3.3V ; also sheet 1,2,5,6
VCC: C6.+ C7.1 C12.1 C13.1 C15.1 C19.2 C33.1 C34.2 C46.2 C47.2 C58.1 C65.1 C67.1 C68.1 C69.1 C70.1 C71.1 R22.2 R24.2 U$3.3(VI) U$16.3(VIN) U$16.4(VCTRL) ; also sheet 1,2,4,5
Unconnected: U$16.5(NC)

### Notes on the sheet
- DS1818
- 3.3V Generation
- 1000mA, according to LDI1117 datasheet
  (linear regulator though)
- V1.2B:
  - fix pinout of LDI1117
  V1.3B:
  - adapt C values
  V1.4A:
  - fix bypass caps for Spartan 6, RGB
  V2.0A:
  - V33 and V12 only, no V25 needed (VCCAUX is 3.3V now)
- CSA-ULTRACPU-V2.0B
- (C) A. Fachat
- CSA-ULTRACPU-V2.0A-20240328

## Sheet 4 of 6: A/V Out
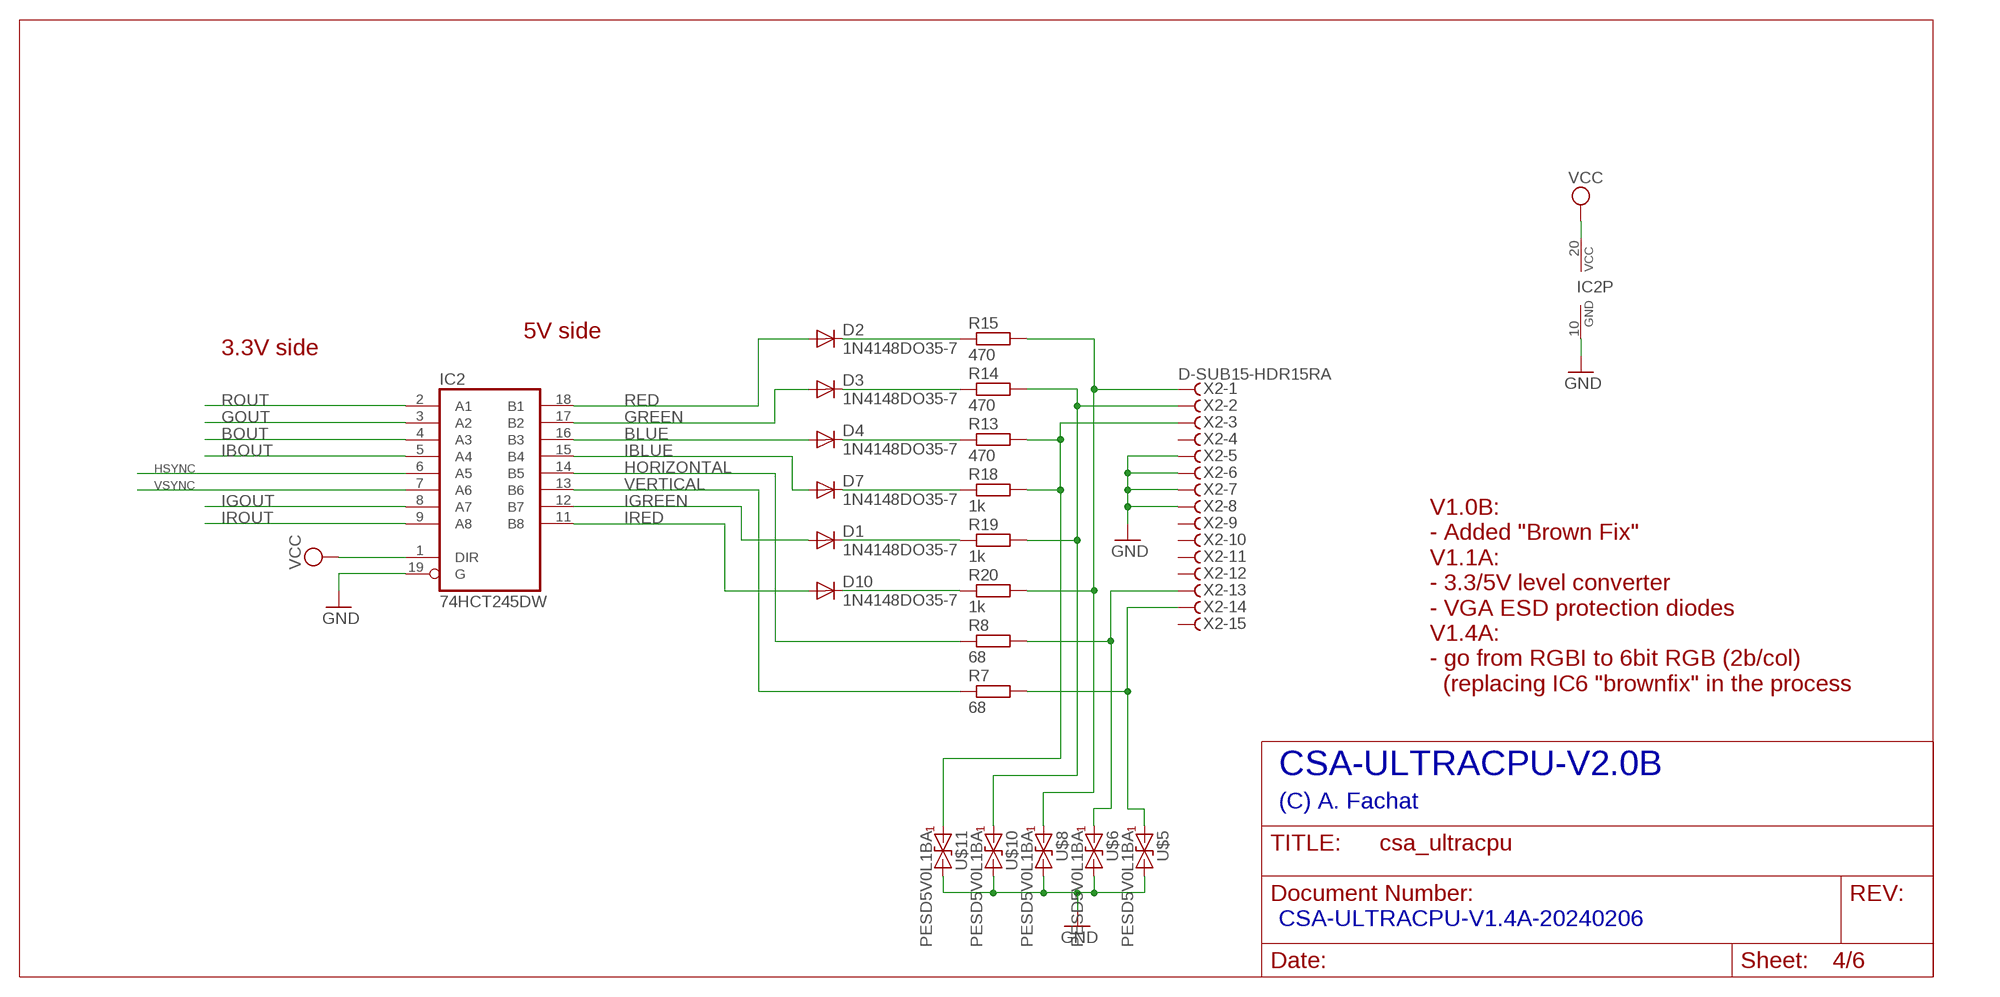
[diagram p4: schematic, sheet 4]

### Parts
D1  1N4148DO35-7  [DO35-7]
D2  1N4148DO35-7  [DO35-7]
D3  1N4148DO35-7  [DO35-7]
D4  1N4148DO35-7  [DO35-7]
D7  1N4148DO35-7  [DO35-7]
D10  1N4148DO35-7  [DO35-7]
IC2  74HCT245DW  74LS245DW  [SO20W]
R7  68  R-EU_0204/2V  [0204V]
R8  68  R-EU_0204/2V  [0204V]
R13  470  R-EU_0204/2V  [0204V]
R14  470  R-EU_0204/2V  [0204V]
R15  470  R-EU_0204/2V  [0204V]
R18  1k  R-EU_0204/2V  [0204V]
R19  1k  R-EU_0204/2V  [0204V]
R20  1k  R-EU_0204/2V  [0204V]
U$5  PESD5V0L1BA  ESDBIDIR  [SOD323]
U$6  PESD5V0L1BA  ESDBIDIR  [SOD323]
U$8  PESD5V0L1BA  ESDBIDIR  [SOD323]
U$10  PESD5V0L1BA  ESDBIDIR  [SOD323]
U$11  PESD5V0L1BA  ESDBIDIR  [SOD323]
X2  D-SUB15-HDR15RA  [HDR15RA]

### Nets
BLUE: D4.A IC2.16(B3)
BOUT: IC2.4(A3) ; also sheet 2
GND: IC2.10(GND) IC2.19(G) U$5.1 U$6.1 U$8.1 U$10.1 U$11.1 X2.5 X2.6 X2.7 X2.8 ; also sheet 1,2,3,5,6
GOUT: IC2.3(A2) ; also sheet 2
GREEN: D3.A IC2.17(B2)
HORIZONTAL: IC2.14(B5) R8.1
HSYNC: IC2.6(A5) ; also sheet 2
IBLUE: D7.A IC2.15(B4)
IBOUT: IC2.5(A4) ; also sheet 2
IGOUT: IC2.8(A7) ; also sheet 2
IGREEN: D1.A IC2.12(B7)
IRED: D10.A IC2.11(B8)
IROUT: IC2.9(A8) ; also sheet 2
N$14: D1.C R19.1
N$16: D7.C R18.1
N$17: R15.2 R20.2 U$8.2 X2.1
N$18: R14.2 R19.2 U$10.2 X2.2
N$19: R13.2 R18.2 U$11.2 X2.3
N$20: D10.C R20.1
N$24: R8.2 U$6.2 X2.13
N$25: R7.2 U$5.2 X2.14
N$31: D2.C R15.1
N$32: D3.C R14.1
N$33: D4.C R13.1
RED: D2.A IC2.18(B1)
ROUT: IC2.2(A1) ; also sheet 2
VCC: IC2.1(DIR) IC2.20(VCC) ; also sheet 1,2,3,5
VERTICAL: IC2.13(B6) R7.1
VSYNC: IC2.7(A6) ; also sheet 2
Unconnected: X2.4 X2.9 X2.10 X2.11 X2.12 X2.15

### Notes on the sheet
- 5V side
- 3.3V side
- V1.0B: 
  - Added "Brown Fix"
  V1.1A:
  - 3.3/5V level converter
  - VGA ESD protection diodes
  V1.4A:
  - go from RGBI to 6bit RGB (2b/col)
    (replacing IC6 "brownfix" in the process
- CSA-ULTRACPU-V2.0B
- (C) A. Fachat
- CSA-ULTRACPU-V1.4A-20240206

## Sheet 5 of 6: USB
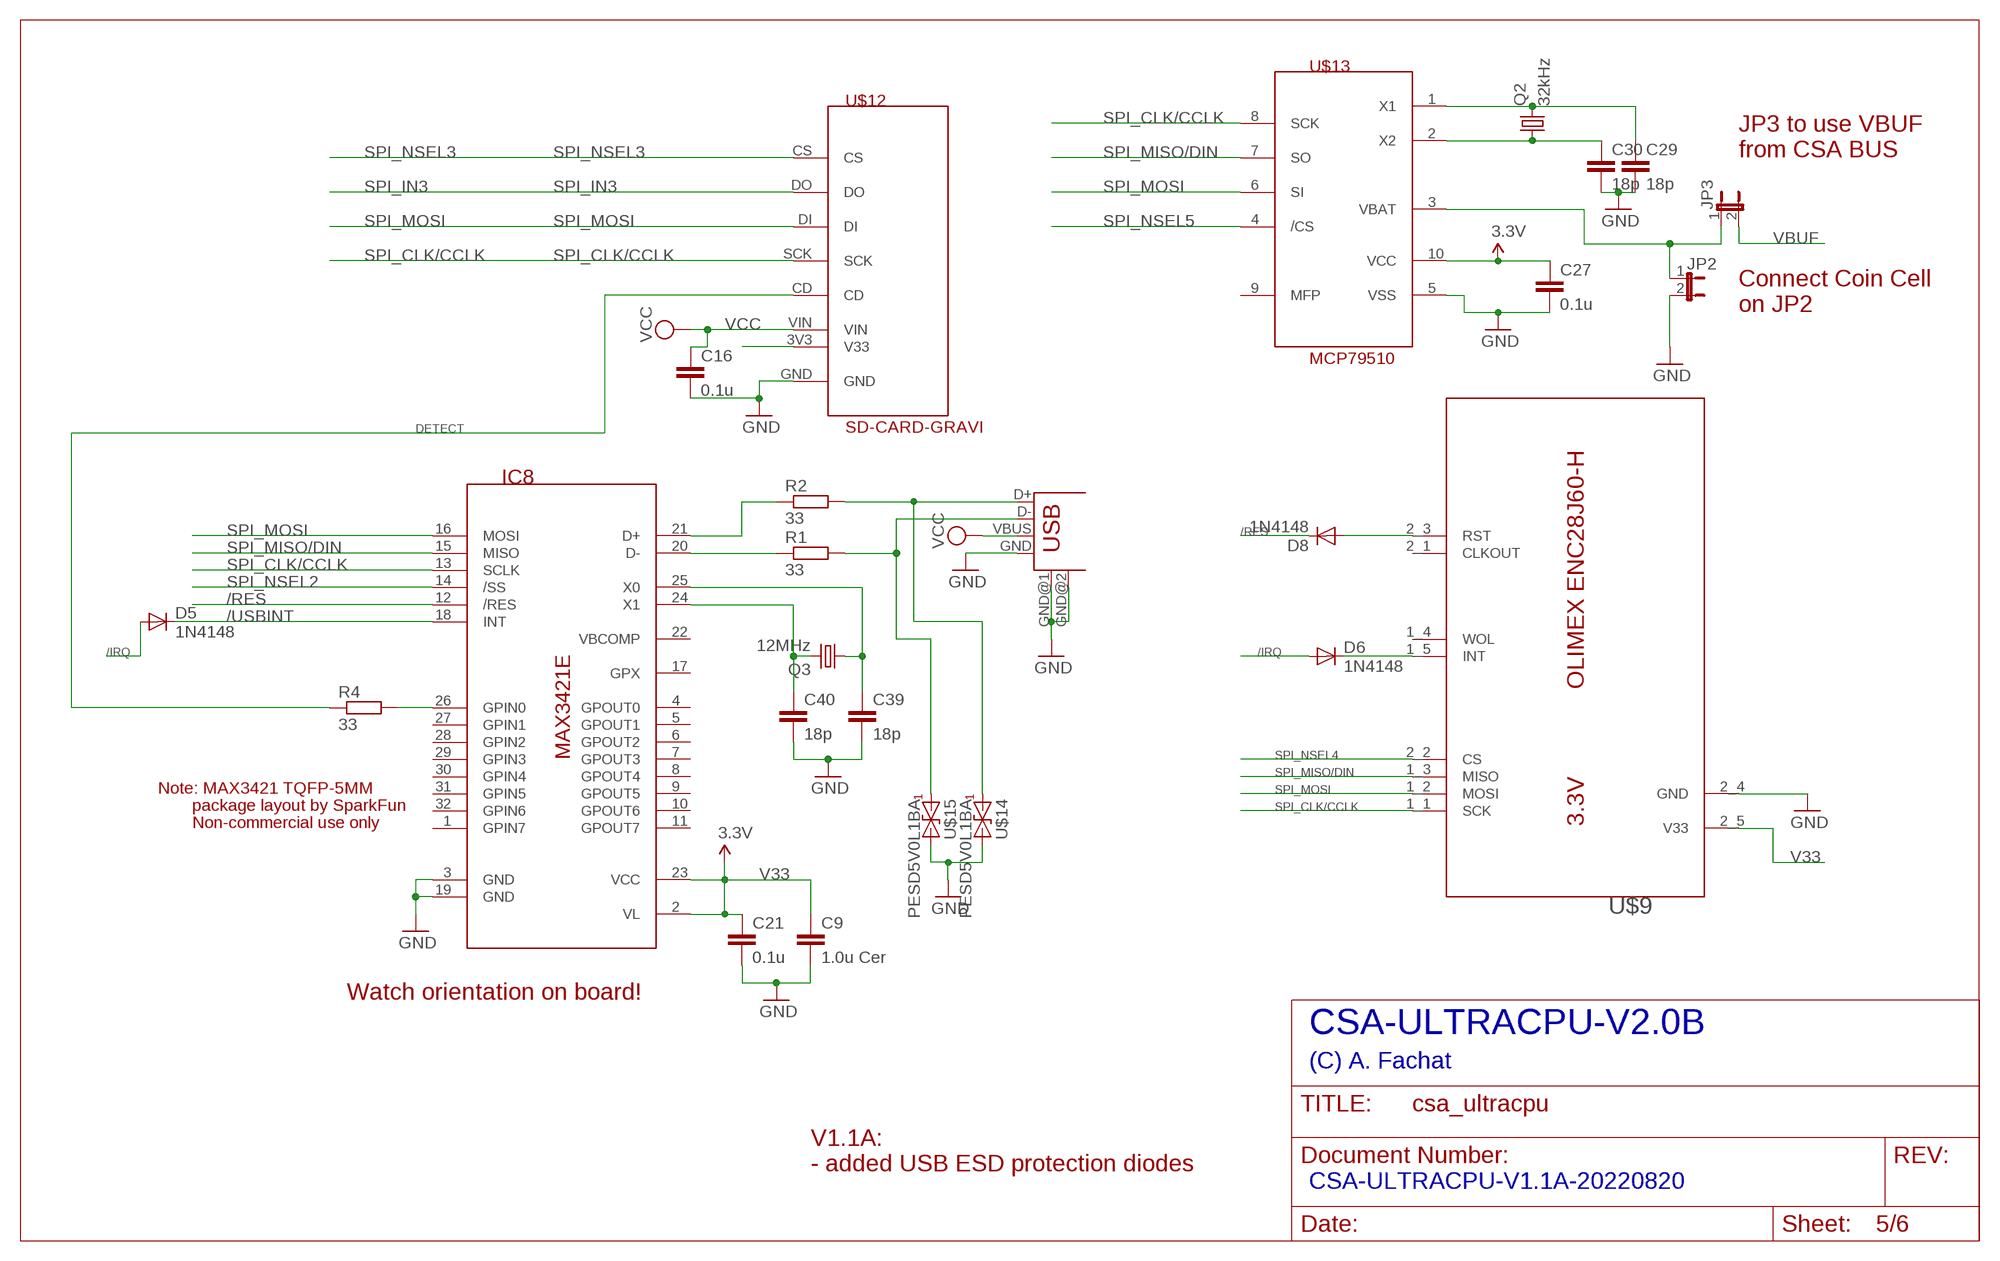
[diagram p5: schematic, sheet 5]

### Parts
C9  1.0u Cer  C-EUC0603  [C0603]
C16  0.1u  C-EUC0603  [C0603]
C21  0.1u  C-EUC0603  [C0603]
C27  0.1u  C-EUC0603  [C0603]
C29  18p  C-EUC0603  [C0603]
C30  18p  C-EUC0603  [C0603]
C39  18p  C-EUC0603  [C0603]
C40  18p  C-EUC0603  [C0603]
D5  1N4148  DIODE-D-5  [D-5]
D6  1N4148  DIODE-D-5  [D-5]
D8  1N4148  DIODE-D-5  [D-5]
IC8  MAX3421E  [TQFP32-5MM]
JP2  JP1E  [JP1]
JP3  JP1E  [JP1]
Q2  32kHz  CRYSTALTC26H  [TC26H]
Q3  12MHz  CRYSTALHC49S  [HC49/S]
R1  33  R-EU_0204/7  [0204/7]
R2  33  R-EU_0204/7  [0204/7]
R4  33  R-EU_0204/7  [0204/7]
U$9  ETHOLIENC  [ETHOLIENC]
U$12  SD-CARD-GRAVI  [GRAVITECH-SDCARD]
U$13  MCP79510  [MSOP10]
U$14  PESD5V0L1BA  ESDBIDIR  [SOD323]
U$15  PESD5V0L1BA  ESDBIDIR  [SOD323]
USB1  USB-A-H  [USB-A-H]

### Nets
12MHZ: C40.1 IC8.24(X1) Q3.2
/IRQ: D5.A D6.A ; also sheet 1,2
/RES: D8.C IC8.12(/RES) ; also sheet 1,2,3
/USBINT: D5.C IC8.18(INT)
DETECT: R4.1 U$12.CD
FOO: U$12.3V3(V33)
GND: C9.2 C16.2 C21.2 C27.2 C29.2 C30.2 C39.2 C40.2 IC8.3(GND) IC8.19(GND) JP2.2 U$9.2_4(GND) U$12.GND U$13.5(VSS) U$14.1 U$15.1 USB1.GND USB1.GND@1(GND) USB1.GND@2(GND) ; also sheet 1,2,3,4,6
N$13: IC8.20(D-) R1.1
N$15: IC8.21(D+) R2.1
N$30: C29.1 Q2.2 U$13.1(X1)
N$34: D6.C U$9.1_5(INT)
N$35: R2.2 U$14.2 USB1.D+
N$36: R1.2 U$15.2 USB1.D-
N$37: IC8.26(GPIN0) R4.2
N$47: C30.1 Q2.1 U$13.2(X2)
N$48: D8.A U$9.2_3(RST)
N$49: C39.1 IC8.25(X0) Q3.1
SPI_CLK/CCLK: IC8.13(SCLK) U$9.1_1(SCK) U$12.SCK U$13.8(SCK) ; also sheet 2
SPI_IN3: U$12.DO ; also sheet 2
SPI_MISO/DIN: IC8.15(MISO) U$9.1_3(MISO) U$13.7(SO) ; also sheet 2
SPI_MOSI: IC8.16(MOSI) U$9.1_2(MOSI) U$12.DI U$13.6(SI) ; also sheet 2
SPI_NSEL2: IC8.14(/SS) ; also sheet 2
SPI_NSEL3: U$12.CS ; also sheet 2
SPI_NSEL4: U$9.2_2(CS) ; also sheet 2
SPI_NSEL5: U$13.4(/CS) ; also sheet 2
V33: C9.1 C21.1 C27.1 IC8.2(VL) IC8.23(VCC) U$9.2_5(V33) U$13.10(VCC) ; supply symbol labelled 3.3V ; also sheet 1,2,3,6
VBAT: JP2.1 JP3.1 U$13.3(VBAT)
VBUF: JP3.2 ; also sheet 1
VCC: C16.1 U$12.VIN USB1.VBUS ; also sheet 1,2,3,4
Unconnected: IC8.1(GPIN7) IC8.4(GPOUT0) IC8.5(GPOUT1) IC8.6(GPOUT2) IC8.7(GPOUT3) IC8.8(GPOUT4) IC8.9(GPOUT5) IC8.10(GPOUT6) IC8.11(GPOUT7) IC8.17(GPX) IC8.22(VBCOMP) IC8.27(GPIN1) IC8.28(GPIN2) IC8.29(GPIN3) IC8.30(GPIN4) IC8.31(GPIN5) IC8.32(GPIN6) U$9.1_4(WOL) U$9.2_1(CLKOUT) U$13.9(MFP)

### Notes on the sheet
- JP3 to use VBUF
  from CSA BUS
- Connect Coin Cell
  on JP2
- Note: MAX3421 TQFP-5MM
- package layout by SparkFun
- Non-commercial use only
- Watch orientation on board!
- CSA-ULTRACPU-V2.0B
- (C) A. Fachat
- V1.1A:
  - added USB ESD protection diodes
- CSA-ULTRACPU-V1.1A-20220820

## Sheet 6 of 6: Audio/Video
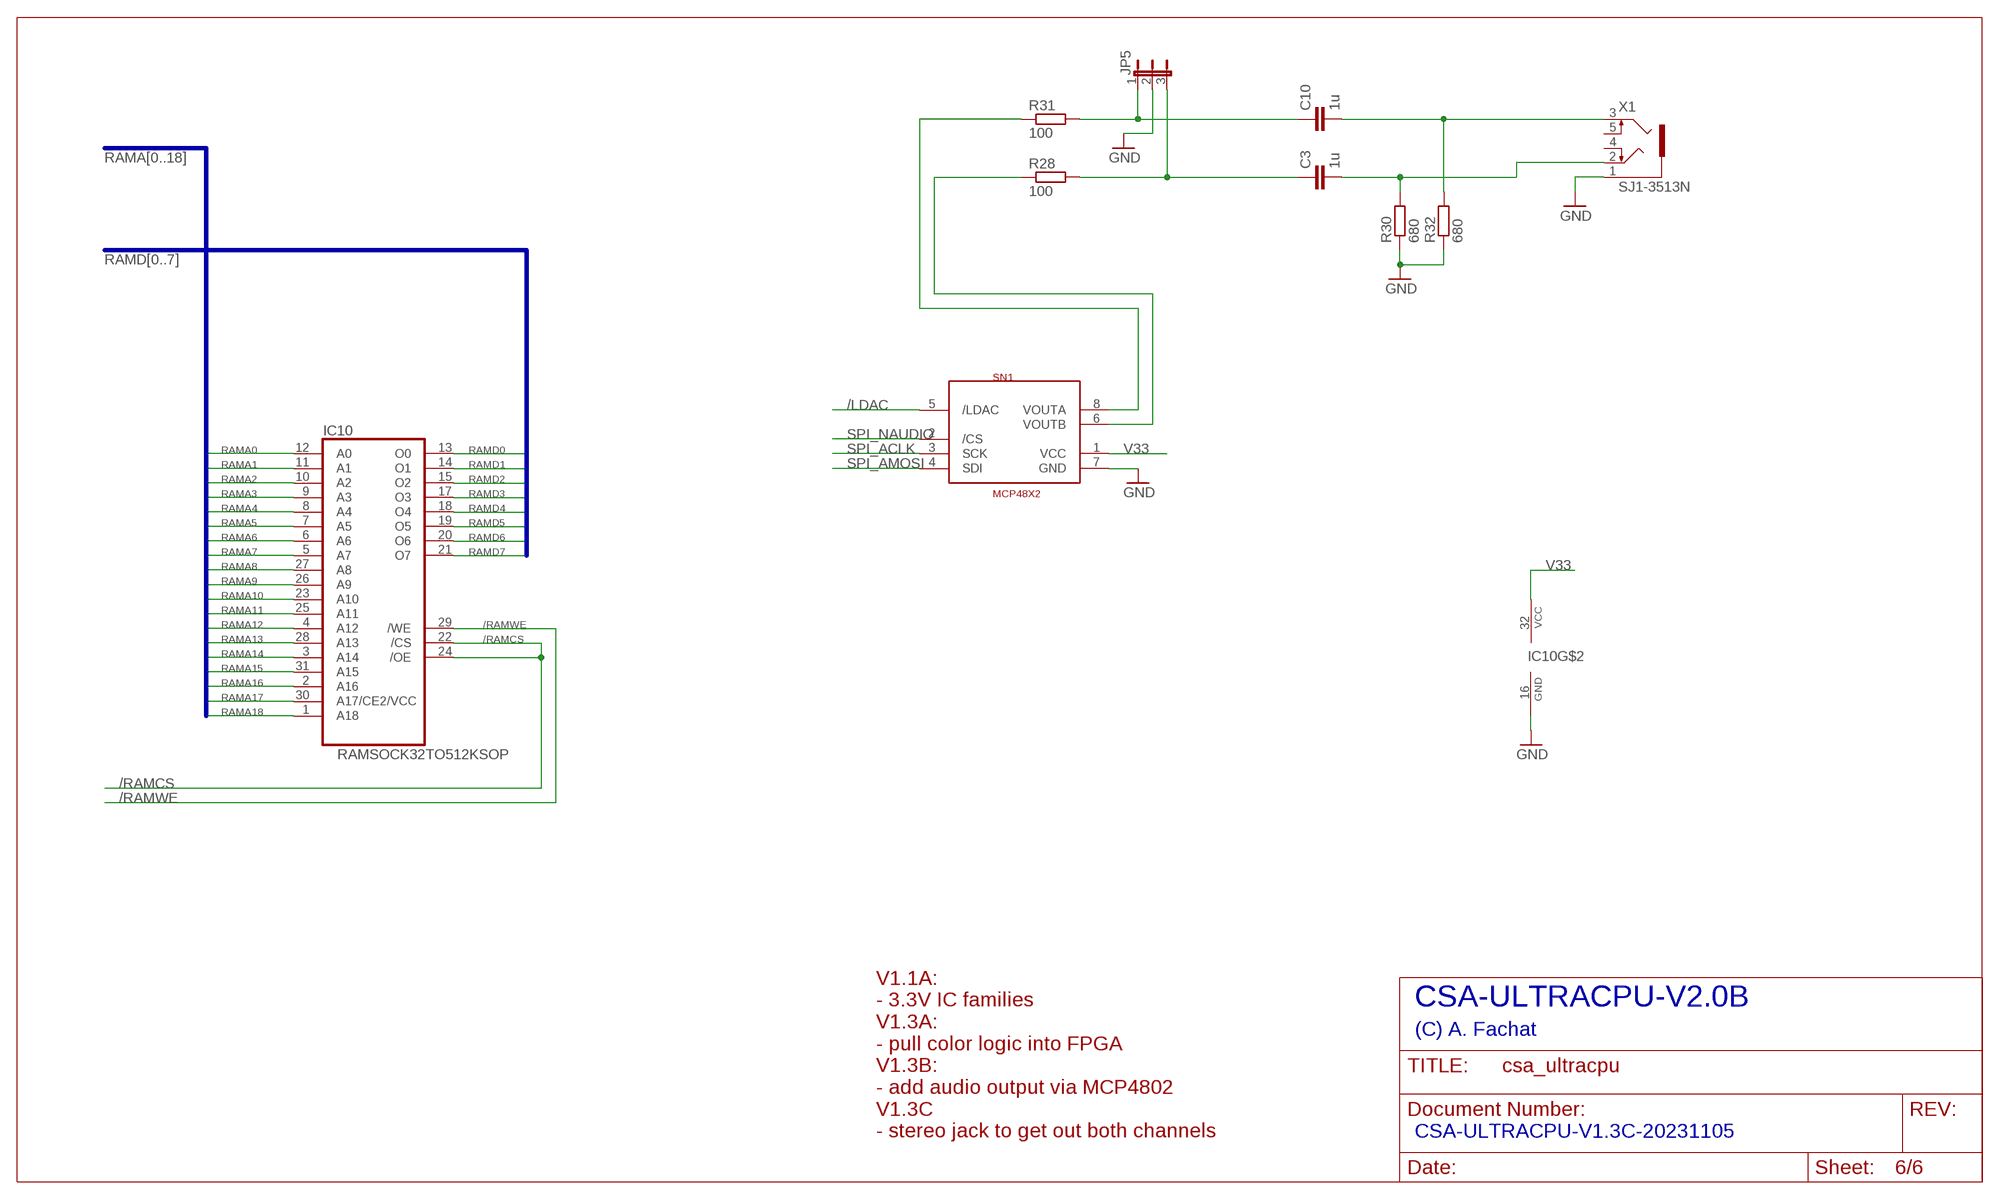
[diagram p6: schematic, sheet 6]

### Parts
C3  1u  C-EU050-025X075  [C050-025X075]
C10  1u  C-EU050-025X075  [C050-025X075]
IC10  RAMSOCK32TO512KSOP  [SOP32]
JP5  JP2E  [JP2]
R28  100  R-EU_0204/2V  [0204V]
R30  680  R-EU_0204/2V  [0204V]
R31  100  R-EU_0204/2V  [0204V]
R32  680  R-EU_0204/2V  [0204V]
SN1  MCP48X2  [SOIC8]
X1  SJ1-3513N  1503_09  [1503_09]

### Nets
/LDAC: SN1.5(/LDAC) ; also sheet 2
/RAMCS: IC10.22(/CS) IC10.24(/OE) ; also sheet 2
/RAMWE: IC10.29(/WE) ; also sheet 2
GND: IC10.16(GND) JP5.2 R30.1 R32.1 SN1.7(GND) X1.1 ; also sheet 1,2,3,4,5
N$22: R28.1 SN1.6(VOUTB)
N$23: C3.2 R30.2 X1.2
N$26: R31.1 SN1.8(VOUTA)
N$27: C10.1 JP5.1 R31.2
N$28: C10.2 R32.2 X1.3
N$42: C3.1 JP5.3 R28.2
RAMA0: IC10.12(A0) ; also sheet 2
RAMA1: IC10.11(A1) ; also sheet 2
RAMA2: IC10.10(A2) ; also sheet 2
RAMA3: IC10.9(A3) ; also sheet 2
RAMA4: IC10.8(A4) ; also sheet 2
RAMA5: IC10.7(A5) ; also sheet 2
RAMA6: IC10.6(A6) ; also sheet 2
RAMA7: IC10.5(A7) ; also sheet 2
RAMA8: IC10.27(A8) ; also sheet 2
RAMA9: IC10.26(A9) ; also sheet 2
RAMA10: IC10.23(A10) ; also sheet 2
RAMA11: IC10.25(A11) ; also sheet 2
RAMA12: IC10.4(A12) ; also sheet 2
RAMA13: IC10.28(A13) ; also sheet 2
RAMA14: IC10.3(A14) ; also sheet 2
RAMA15: IC10.31(A15) ; also sheet 2
RAMA16: IC10.2(A16) ; also sheet 2
RAMA17: IC10.30(A17/CE2/VCC) ; also sheet 2
RAMA18: IC10.1(A18) ; also sheet 2
RAMD0: IC10.13(O0) ; also sheet 2
RAMD1: IC10.14(O1) ; also sheet 2
RAMD2: IC10.15(O2) ; also sheet 2
RAMD3: IC10.17(O3) ; also sheet 2
RAMD4: IC10.18(O4) ; also sheet 2
RAMD5: IC10.19(O5) ; also sheet 2
RAMD6: IC10.20(O6) ; also sheet 2
RAMD7: IC10.21(O7) ; also sheet 2
SPI_ACLK: SN1.3(SCK) ; also sheet 2
SPI_AMOSI: SN1.4(SDI) ; also sheet 2
SPI_NAUDIO: SN1.2(/CS) ; also sheet 2
V33: IC10.32(VCC) SN1.1(VCC) ; also sheet 1,2,3,5
Unconnected: X1.4 X1.5

### Buses
RAMD[0..7]
RAMA[0..18]

### Notes on the sheet
- CSA-ULTRACPU-V2.0B
- (C) A. Fachat
- V1.1A:
  - 3.3V IC families
  V1.3A: 
  - pull color logic into FPGA
  V1.3B:
  - add audio output via MCP4802
  V1.3C
  - stereo jack to get out both channels
- CSA-ULTRACPU-V1.3C-20231105

## Power pins joined to a net without a drawn wire
GND: IC4.10(GND) IC5.10(GND) IC13.10(P:GND) IC19.10(P:GND)
VCC: IC4.20(VCC) IC5.20(VCC) IC13.20(P:VCC) IC19.20(P:VCC)

## Library data of the parts
C1-C5 C7-C22 C24-C37 C39-C49 C54-C58 C64-C71 C100-C113 C120 C121 C123 = rcl:C-EU: CAPACITOR, European symbol
C6 C38 = rcl:CPOL-EU: POLARIZED CAPACITOR, European symbol
D1-D4 D7 D10 = diode:1N4148: DIODE high speed (Philips)
D5 D6 D8 D9 = diode:DIODE-: DIODE
DS1818 = csa:DS1813
H3 H4 = holes:MOUNT-HOLE: MOUNTING HOLE with drill center marker
IC1 IC10 = csa:RAMSOCK32TO512K
IC2 IC4 IC5 = 74xx-eu:74*245: Octal BUS TRANSCEIVER, 3-state
IC3 = 74xx-eu:74*125: Quad bus BUFFER, 3-state
IC6 = 74xx-little-us:74*1G04: INVERTER Gate
IC7 = 74xx-eu:74*138: 3-line to 8-line DECODER/DEMULTIPLEXER
IC8 = csa:MAX3421E
IC13 IC19 = 74xx-eu:74*244: Octal BUFFER and LINE DRIVER, 3-state
IC14 = 74xx-eu:74*14: Hex schmitt trigger INVERTER
IC16 = csa:74LVC8T245
IC18 = 74xx-eu:74*06: Hex INVERTER, open collector high-voltage output
JP1-JP4 JP6 = jumper:JP1E: JUMPER
JP5 = jumper:JP2E: JUMPER
JP7 = jumper:JP4E: JUMPER
JP8-JP11 = csa:PIN
JS1 = csa:RENOSC
LED1 = led:LED: LED OSRAM: - CHIPLED LG R971, LG N971, LY N971, LG Q971, LY Q971, LO R971, LY R971 LH N974, LH R974 LS Q976, LO Q976, LY Q976 LO Q996 - Hyper CHIPLED LW Q18S LB Q993, LB Q99A, LB R99A - SideLED LS A670, LO A670, LY A670, LG A670, LP A670 LB A673, LV A673, LT A673, LW A673 LH A674 LY A675 LS A676, LA A676, LO A676, LY A676, LW A676 LS A679, LY A679, LG A679 - Hyper Micro SIDELED® LS Y876, LA Y876, LO Y876, LY Y876 LT Y87S - SmartLED LW L88C, LW L88S LB L89C, LB L89S, LG L890 LS L89K, LO L89K, LY L89K LS L896, LA L896, LO L896, LY L896 - TOPLED LS T670, LO T670, LY T670, LG T670, LP T670 LSG T670, LSP T670, LSY T670, LOP T670, LYG T670 LG T671, LOG T671, LSG T671 LB T673, LV T673, LT T673, LW T673 LH T674 LS T676, LA T676, LO T676, LY T676, LB T676, LH T676, LSB T676, LW T676 LB T67C, LV T67C, LT T67C, LS T67K, LO T67K, LY T67K, LW E67C LS E67B, LA E67B, LO E67B, LY E67B, LB E67C, LV E67C, LT E67C LW T67C LS T679, LY T679, LG T679 LS T770, LO T770, LY T770, LG T770, LP T770 LB T773, LV T773, LT T773, LW T773 LH T774 LS E675, LA E675, LY E675, LS T675 LS T776, LA T776, LO T776, LY T776, LB T776 LHGB T686 LT T68C, LB T68C - Hyper Mini TOPLED® LB M676 - Mini TOPLED Santana® LG M470 LS M47K, LO M47K, LY M47K Source: http://www.osram.convergy.de LUXEON: - LUMILED® LXK2-PW12-R00, LXK2-PW12-S00, LXK2-PW14-U00, LXK2-PW14-V00 LXK2-PM12-R00, LXK2-PM12-S00, LXK2-PM14-U00 LXK2-PE12-Q00, LXK2-PE12-R00, LXK2-PE12-S00, LXK2-PE14-T00, LXK2-PE14-U00 LXK2-PB12-K00, LXK2-PB12-L00, LXK2-PB12-M00, LXK2-PB14-N00, LXK2-PB14-P00, LXK2-PB14-Q00 LXK2-PR12-L00, LXK2-PR12-M00, LXK2-PR14-Q00, LXK2-PR14-R00 LXK2-PD12-Q00, LXK2-PD12-R00, LXK2-PD12-S00 LXK2-PH12-R00, LXK2-PH12-S00 LXK2-PL12-P00, LXK2-PL12-Q00, LXK2-PL12-R00 Source: www.luxeon.com KINGBRIGHT: KA-3528ASYC Source: www.kingbright.com
P1 = csa:CSABUS
Q2 = crystal:CRYSTAL: CRYSTAL; OC_FARNELL: unknown; OC_NEWARK: unknown
Q3 = crystal:CRYSTAL: CRYSTAL; OC_FARNELL: 1667008; OC_NEWARK: unknown
QG1 = crystal:CRYSTAL_RES-: CRYSTAL RESONATOR; OC_FARNELL: unknown; OC_NEWARK: unknown
R1 R2 R4-R20 R22 R24-R32 = rcl:R-EU_: RESISTOR, European symbol
RN2 = resistor-net:RN08: RESISTOR NETWORK; OC_FARNELL: unknown; OC_NEWARK: unknown
S1 = switch-omron:31-XX: OMRON SWITCH; MPN: B3F-3100; OC_FARNELL: 959704; OC_NEWARK: 36M3582
SJ1 = jumper:SJ2W: SMD solder JUMPER
SN1 = csa:MCP48X2
U$1 = csa:W65C816S
U$2 = csa:XC9SLX9-TQG144
U$3 = csa:LDI1117
U$4 U$18 = csa:SPIFLASH
U$5 U$6 U$8 U$10 U$11 U$14 U$15 = csa:ESDBIDIR
U$7 = csa:XILINXPROG
U$9 = csa:ETHOLIENC
U$12 = csa:SD-CARD-GRAVI
U$13 = csa:MCP79510
U$16 = csa:AP2132B
USB1 = con-usb-2:USB: USB Connectors
X1 = con-lumberg:1503_09: Jack connectors according to JISC 6560, 3.5 mm Klinkeneinbaukupplung nach JISC 6560, 3,5 mm, 3-polig/ stereo, abgewinkelte Ausführung, mit 2 Öffnern und Lötaugen, für Leiterplatten Rückseitenmontage Source: http://www.lumberg.com/Produkte/PDFs/1503_09.pdf; OC_FARNELL: 1243244; OC_NEWARK: unknown
X2 = con-thomas-betts:D-SUB15-: D-Subminiatur Connector Source: Electronioc Interconnects European Edition 1998; OC_FARNELL: unknown; OC_NEWARK: unknown

## Net classes
0 default: clearance 0.152 mm